# EasyEDA Pro project VCA821_AD8367_AD8302相敏检波_TLC14滤波电容.eprj

# Schematic Schematic1

## Sheets
1 P1: Board Name: Board1; Create Date: 2025-03-30; Page Name: P1; Project Name: VCA821_AD8367_AD8302相敏检波_TLC14滤波电容; Schematic Name: Schematic1; Update Date: 2025-03-31; Company: 嘉立创EDA; Page Size: A4; Version: V1.0
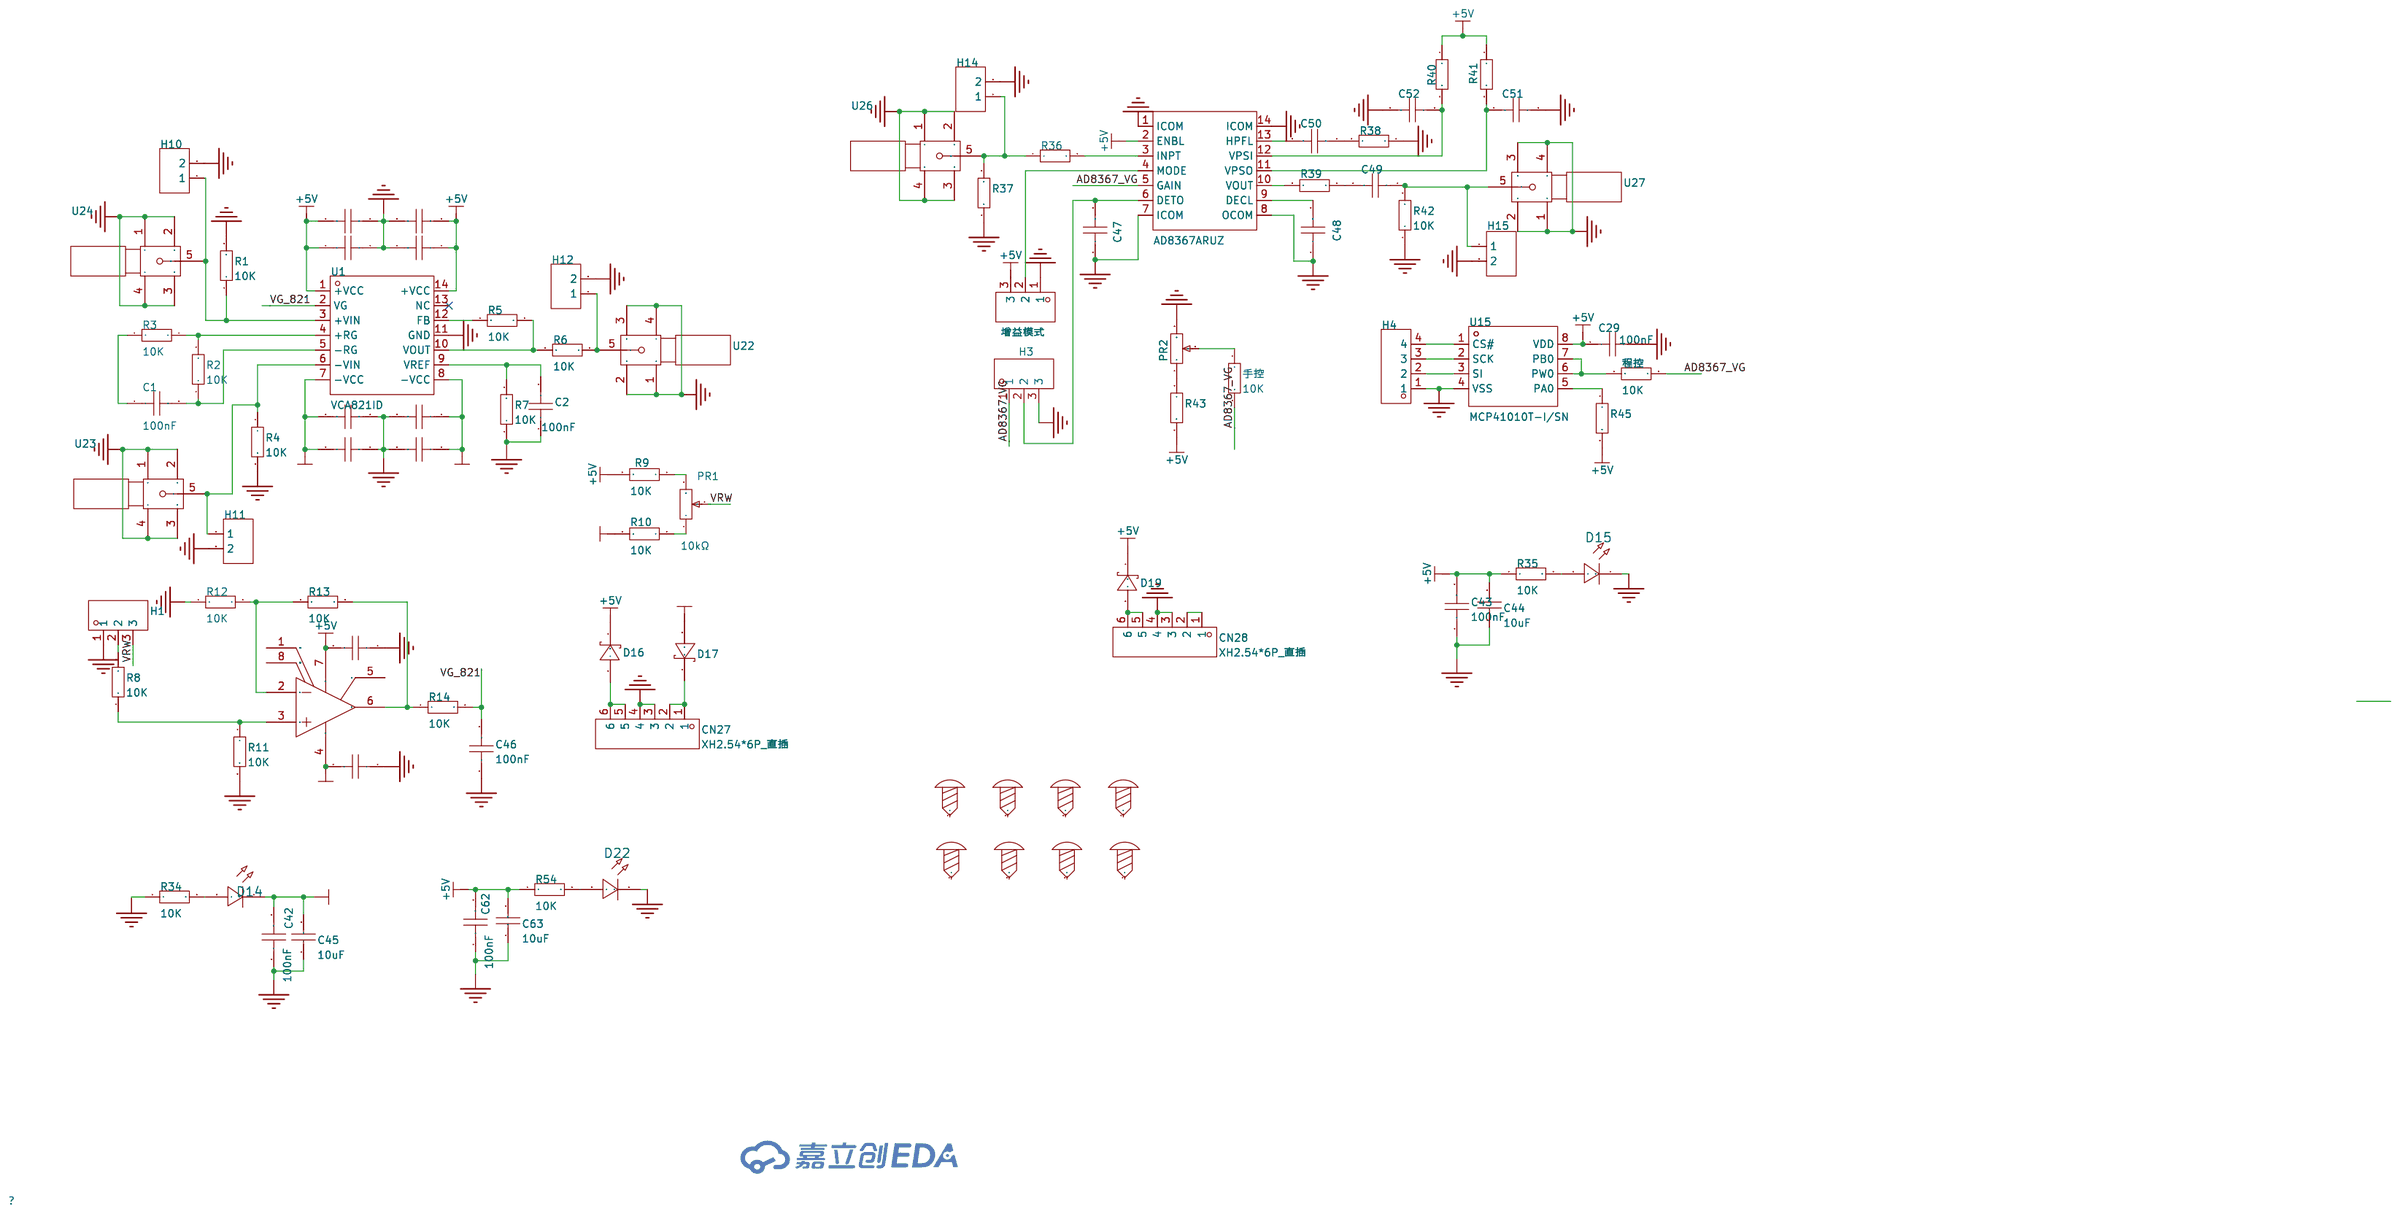
[diagram p0: P1]
2 P2: Page Name: P2
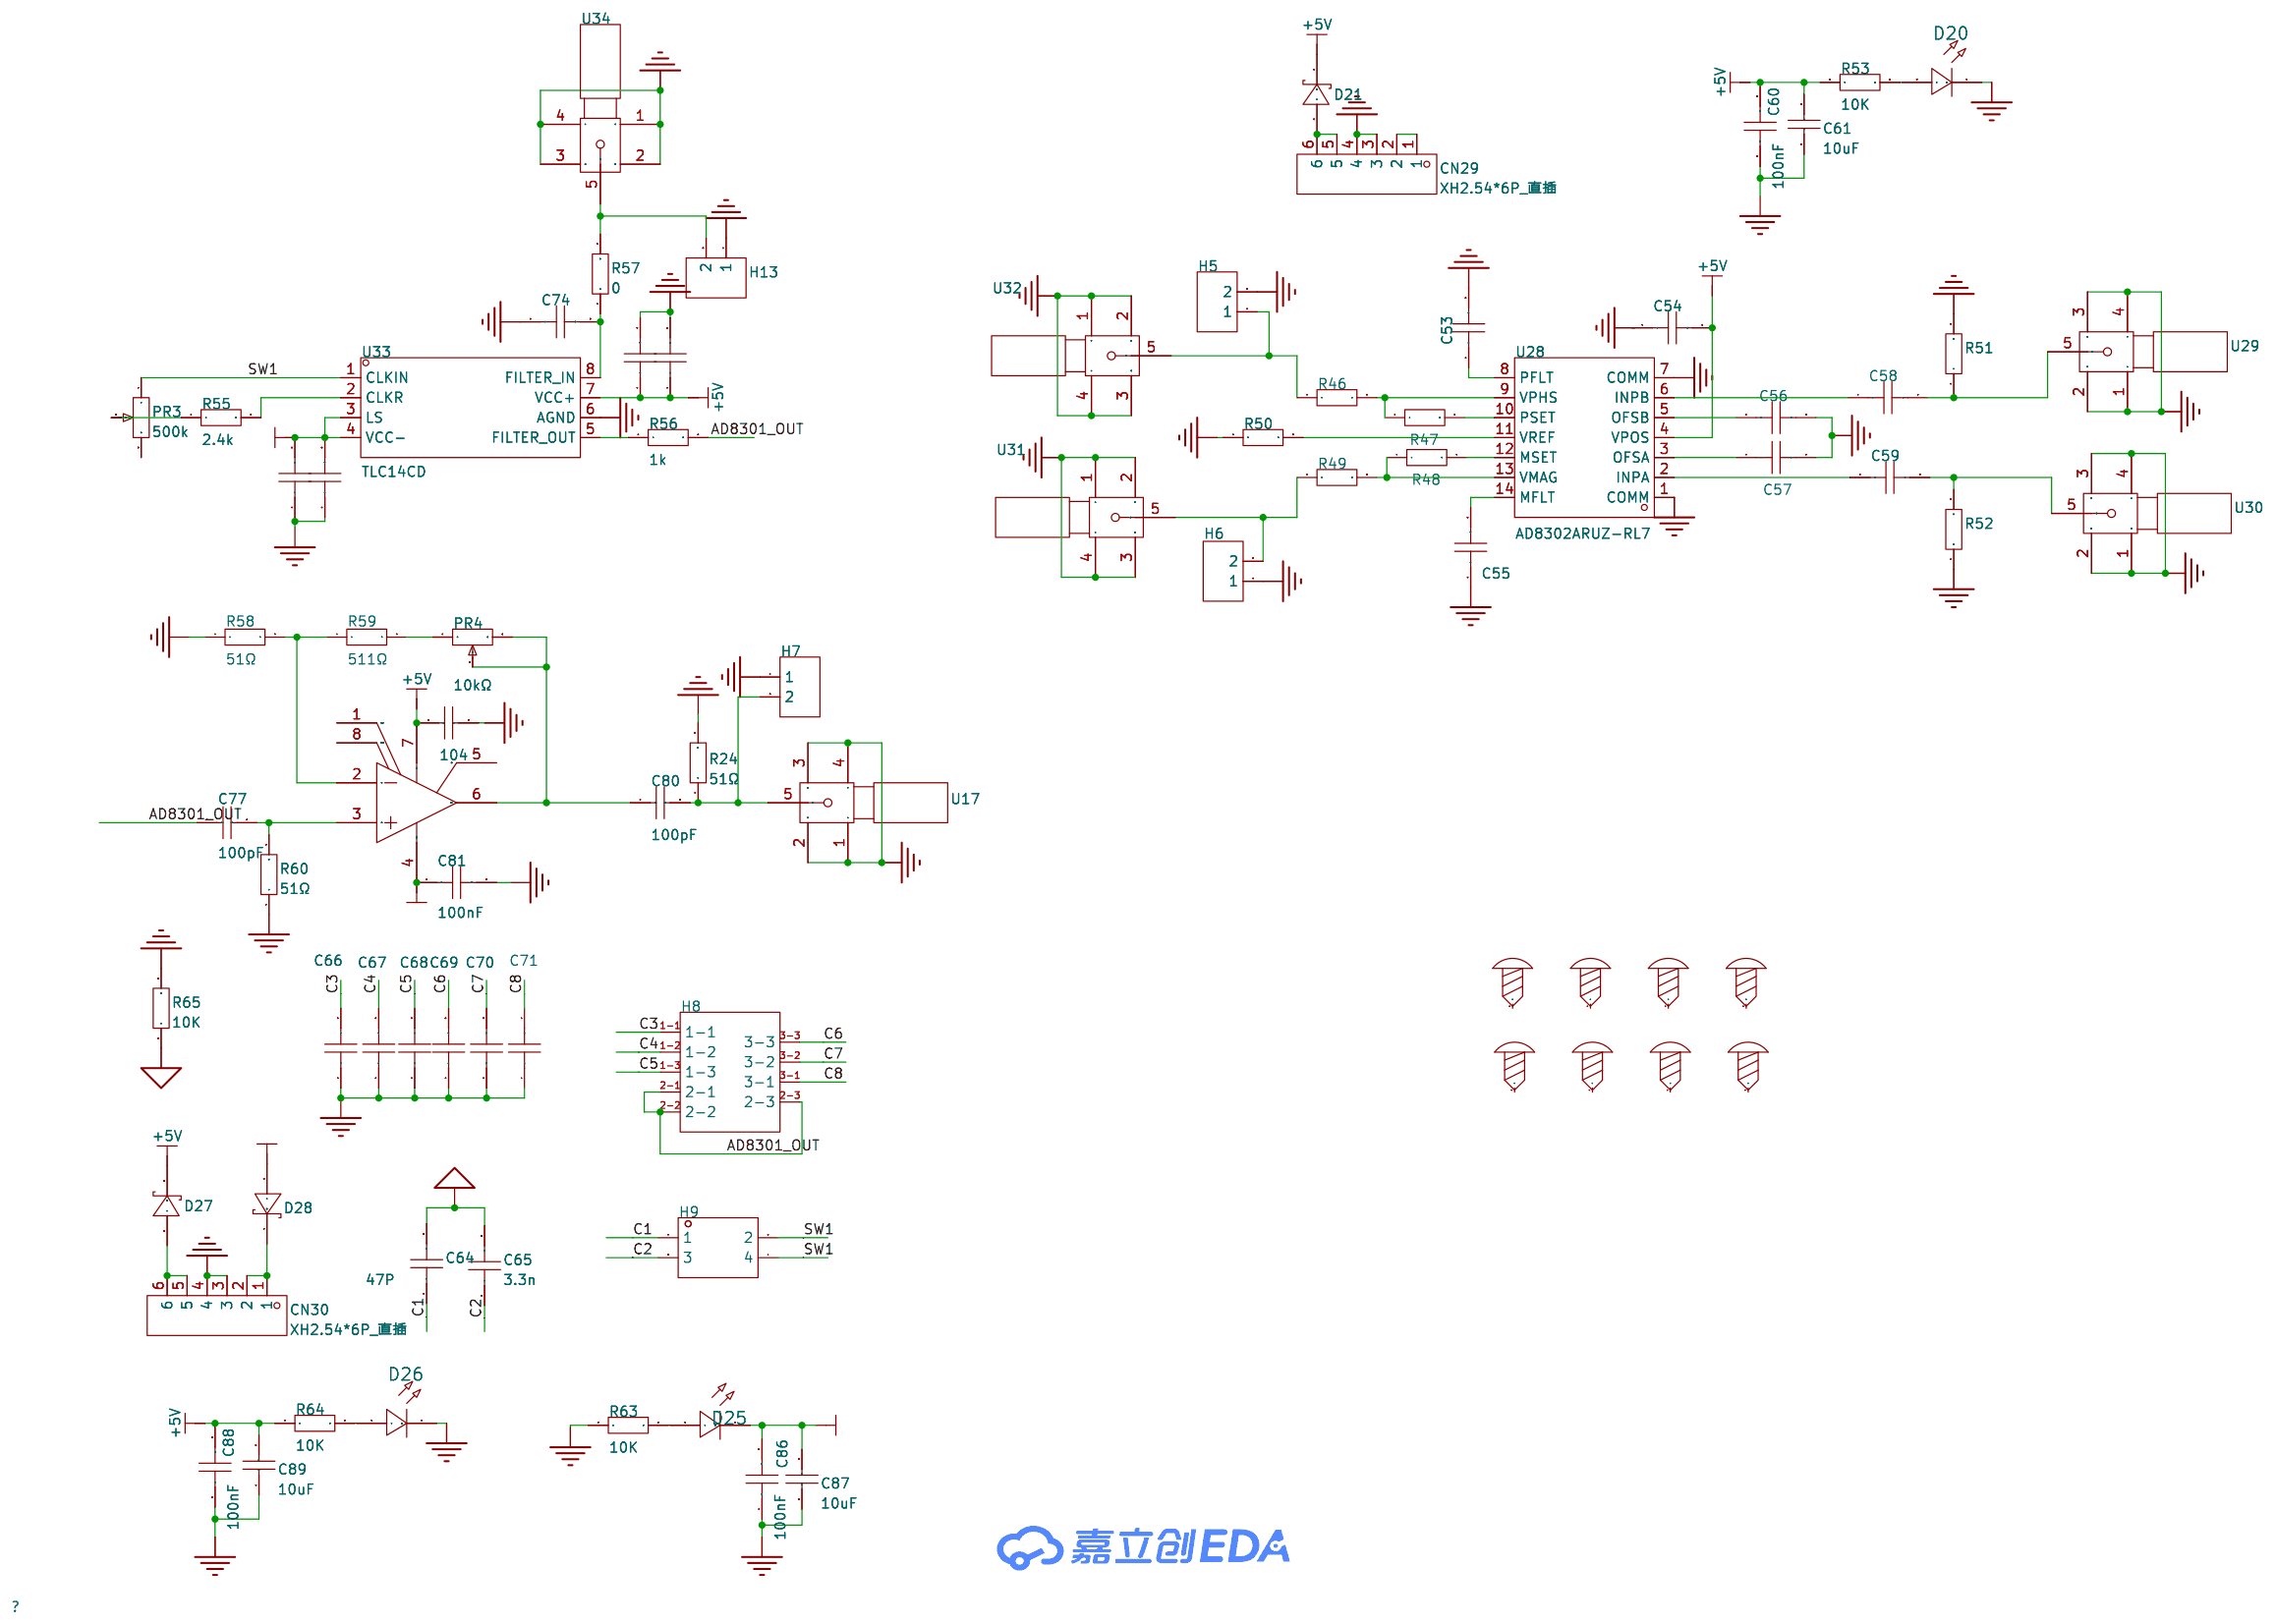
[diagram p1: P2]

## Parts
sheet P1
C1  100nF  [R0805]
C2  100nF  [R0805]
C3  100nF  [R0805]
C4  100nF  [R0805]
C5  100nF  [R0805]
C6  100nF  [R0805]
C7  100nF  [R0805]
C8  100nF  [R0805]
C9  100nF  [R0805]
C10  100nF  [R0805]
C11  100nF  [R0805]
C12  100nF  [R0805]
C29  100nF  [R0805]
C42  100nF  [R0805]
C43  100nF  [R0805]
C44  10uF  [C1210]
C45  10uF  [C1210]
C46  100nF  [R0805]
C47  100nF  [R0805]
C48  100nF  [R0805]
C49  100nF  [R0805]
C50  100nF  [R0805]
C51  100nF  [R0805]
C52  100nF  [R0805]
C62  100nF  [R0805]
C63  10uF  [C1210]
CN27  XH2.54*6P_直插  [CONN-TH_XH2.54-6P]
CN28  XH2.54*6P_直插  [CONN-TH_XH2.54-6P]
D14  -  [LED_0805]
D15  -  [LED_0805]
D16  SD103AWS  [SOD-323_L1.8-W1.3-LS2.5-RD]
D17  SD103AWS  [SOD-323_L1.8-W1.3-LS2.5-RD]
D19  SD103AWS  [SOD-323_L1.8-W1.3-LS2.5-RD]
D22  -  [LED_0805]
H1  -  [HDR-TH_3P-P2.54-V-F]
H3  -  [HDR-TH_3P-P2.54-V-F]
H4  -  [HDR-TH_4P-P2.54-V-F]
H10  -  [HDR-TH_2P-P2.54-V-F]
H11  -  [HDR-TH_2P-P2.54-V-F]
H12  -  [HDR-TH_2P-P2.54-V-F]
H14  -  [HDR-TH_2P-P2.54-V-F]
H15  -  [HDR-TH_2P-P2.54-V-F]
PR1  10kΩ  [R_3296]
PR2  10kΩ  [R_3296]
R1  10K  [R0805]
R2  10K  [R0805]
R3  10K  [R0805]
R4  10K  [R0805]
R5  10K  [R0805]
R6  10K  [R0805]
R7  10K  [R0805]
R8  10K  [R0805]
R9  10K  [R0805]
R10  10K  [R0805]
R11  10K  [R0805]
R12  10K  [R0805]
R13  10K  [R0805]
R14  10K  [R0805]
R34  10K  [R0805]
R35  10K  [R0805]
R36  10K  [R0805]
R37  10K  [R0805]
R38  10K  [R0805]
R39  10K  [R0805]
R40  10K  [R0805]
R41  10K  [R0805]
R42  10K  [R0805]
R43  10K  [R0805]
R45  10K  [R0805]
R54  10K  [R0805]
SCREW1  -  [M3螺丝]
SCREW2  -  [M3螺丝]
SCREW3  -  [M3螺丝]
SCREW4  -  [M3螺丝]
SCREW5  -  [M3螺丝]
SCREW6  -  [M3螺丝]
SCREW7  -  [M3螺丝]
SCREW8  -  [M3螺丝]
U1  VCA821ID  [SOIC-14_L8.7-W3.9-P1.27-LS6.0-BL]
U2  OP07CDR  [SOIC-8_L4.9-W3.9-P1.27-LS6.0-BL]
U15  MCP41010T-I/SN  [SOIC-8_L4.9-W3.9-P1.27-LS6.0-BL]
U22  -  [SMA]
U23  -  [SMA]
U24  -  [SMA]
U25  AD8367ARUZ  [TSSOP-14_L5.0-W4.4-P0.65-LS6.4-BL]
U26  -  [SMA]
U27  -  [SMA]
增益模式  -  [HDR-TH_3P-P2.54-V-F]
手控  10K  [R0805]
程控  10K  [R0805]
sheet P2
C53  100nF  [R0805]
C54  100nF  [R0805]
C55  100nF  [R0805]
C56  100nF  [R0805]
C57  100nF  [R0805]
C58  100nF  [R0805]
C59  100nF  [R0805]
C60  100nF  [R0805]
C61  10uF  [C1210]
C64  47P  [R0805]
C65  3.3n  [R0805]
C66  1nF  [R0805]
C67  100nF  [R0805]
C68  100nF  [R0805]
C69  100nF  [R0805]
C70  100nF  [R0805]
C71  100nF  [R0805]
C72  100nF  [R0805]
C73  100nF  [R0805]
C74  100nF  [R0805]
C75  100nF  [R0805]
C76  100nF  [R0805]
C77  100pF  [R0805]
C79  104  [R0805]
C80  100pF  [R0805]
C81  100nF  [R0805]
C86  100nF  [R0805]
C87  10uF  [C1210]
C88  100nF  [R0805]
C89  10uF  [C1210]
CN29  XH2.54*6P_直插  [CONN-TH_XH2.54-6P]
CN30  XH2.54*6P_直插  [CONN-TH_XH2.54-6P]
D20  -  [LED_0805]
D21  SD103AWS  [SOD-323_L1.8-W1.3-LS2.5-RD]
D25  -  [LED_0805]
D26  -  [LED_0805]
D27  SD103AWS  [SOD-323_L1.8-W1.3-LS2.5-RD]
D28  SD103AWS  [SOD-323_L1.8-W1.3-LS2.5-RD]
H5  -  [HDR-TH_2P-P2.54-V-F]
H6  -  [HDR-TH_2P-P2.54-V-F]
H7  -  [HDR-TH_2P-P2.54-V-F]
H8  PZ254-3-03-Z-2.5-G0  [HDR-TH_9P-P2.54-V-M-R3-C3-S2.54]
H9  -  [HDR-TH_4P-P2.54-V-F-R2-C2-S2.54]
H13  -  [HDR-TH_2P-P2.54-V-F]
PR3  500k  [R_3296]
PR4  10kΩ  [R_3296]
R24  51Ω  [R0805]
R46  10K  [R0805]
R47  10K  [R0805]
R48  10K  [R0805]
R49  10K  [R0805]
R50  10K  [R0805]
R51  10K  [R0805]
R52  10K  [R0805]
R53  10K  [R0805]
R55  2.4k  [R0805]
R56  1k  [R0805]
R57  0  [R0805]
R58  51Ω  [R0805]
R59  511Ω  [R0805]
R60  51Ω  [R0805]
R63  10K  [R0805]
R64  10K  [R0805]
R65  10K  [R0805]
SCREW17  -  [M3螺丝]
SCREW18  -  [M3螺丝]
SCREW19  -  [M3螺丝]
SCREW20  -  [M3螺丝]
SCREW21  -  [M3螺丝]
SCREW22  -  [M3螺丝]
SCREW23  -  [M3螺丝]
SCREW24  -  [M3螺丝]
U17  -  [SMA]
U28  AD8302ARUZ-RL7  [TSSOP-14_L5.0-W4.4-P0.65-LS6.4-BL]
U29  -  [SMA]
U30  -  [SMA]
U31  -  [SMA]
U32  -  [SMA]
U33  TLC14CD  [SOIC-8_L4.9-W3.9-P1.27-LS6.0-BL]
U34  -  [SMA]
U35  OP07CDR  [SOIC-8_L4.9-W3.9-P1.27-LS6.0-BL]

## Library data of the parts
C1-C12 C29 C42 C43 C46-C60 C62 C64-C76 C81 C86 C88 = CAP_0805: Supplier Footprint: 0805
C44 C45 C61 C63 C87 C89 = CL32B106KAJNNNE: 容值:10uF;精度:±10%;额定电压:25V;材质(温度系数):X7R;; LCSC Part Name: 10uF ±10% 25V; Supplier Part: C39232; Manufacturer: SAMSUNG(三星); Supplier Footprint: 1210; JLCPCB Part Class: 扩展库; Datasheet: https://atta.szlcsc.com/upload/public/pdf/source/20160218/1457707763339.pdf; Supplier: LCSC; Tolerance: ±10%; Voltage Rated: 25V; Temperature Coefficient: X7R
CN27-CN30 = XH2.54*6P_直插: Supplier Part: C9900008614; Supplier Footprint: XH2.54_6P; JLCPCB Part Class: 扩展库; Supplier: LCSC
D14 D15 D20 D22 D25 D26 = LED_0805-R: Supplier Footprint: 0805
D16 D17 D19 D21 D27 D28 = SD103AWS_C181207: 正向压降(Vf):600mV@200mA;直流反向耐压(Vr):40V;整流电流:350mA;; LCSC Part Name: 电压:40V 电流:350mA 丝印S4; Supplier Part: C181207; Manufacturer: Hottech(合科泰); Supplier Footprint: SOD-323; JLCPCB Part Class: 扩展库; Datasheet: https://atta.szlcsc.com/upload/public/pdf/source/20240513/4691873FBB9173EFBCF4C6FD4BBA1025.pdf; Supplier: LCSC; Forward Voltage (Vf@If): 600mV@200mA; Reverse Voltage (Vr): 40V; Rectified Current: 350mA
H1 H3 增益模式 = HDR-F_2.54_1x3P: Supplier Part: C541850; Supplier Footprint: 插件
H4 = HDR-F_2.54_1x4P: Supplier Part: C2718488; Supplier Footprint: 插件
H5-H7 H10-H15 = HDR-F_2.54_1x2P: Supplier Part: C49661; Supplier Footprint: 插件
PR1-PR4 = R_3296: Supplier Footprint: 直插
R1-R14 R34-R43 R45-R57 R63-R65 手控 程控 = Res_0805: Supplier Footprint: 0805
SCREW1-SCREW8 SCREW17-SCREW24 = M3螺丝: Supplier Footprint: 插件
U1 = VCA821ID: Supplier Part: C2866982; Manufacturer: TI(德州仪器); Supplier Footprint: SOIC-14; JLCPCB Part Class: 扩展库; Datasheet: https://www.ti.com/cn/lit/gpn/vca821; Supplier: LCSC; Amplifier Type: VGA; Number of Channels: 单路; Bandwidth (-3dB): 710MHz; Slew Rate (SR): 2500V/us; Output Current: 90mA; Supply Current: 34mA; Operating Temperature: -40℃~+85℃
U2 U35 = OP07CDR: LCSC Part Name: 精密运算放大器; Supplier Part: C7433; Manufacturer: TI(德州仪器); Supplier Footprint: SOIC-8; JLCPCB Part Class: 基础库; Datasheet: http://www.ti.com/cn/lit/gpn/op07c; Supplier: LCSC; Number of Circuits: 单路; Gain Bandwidth Product(GBP): 600kHz; Current - Input Bias(Ib): 1.8nA; Slew Rate(SR): 0.3V/us; Operating Temperature: 0℃~+70℃
U15 = MCP41010T-I/SN: 电阻值(欧姆):10kΩ;精度:±20%;供电电压:2.7V~5.5V;接口类型:SPI;; Supplier Part: C136395; Manufacturer: MICROCHIP(美国微芯); Supplier Footprint: SOIC-8-150mil; JLCPCB Part Class: 扩展库; Datasheet: https://atta.szlcsc.com/upload/public/pdf/source/20220205/C2666606_C5E8E7A5F3891B321C1555D845654E7B.pdf; Supplier: LCSC; Resistance Value (Ohms): 10kΩ; Number of Taps: 256; Number of Channels: 1; Precision: ±20%; Supply Voltage: 2.7V~5.5V; Interface Type: SPI; Temperature Coefficient (Typ): 800ppm/℃; Operating Temperature: -40℃~+85℃
U17 U22-U24 U26 U27 U29-U32 U34 = SMA
U25 = AD8367ARUZ: LCSC Part Name: 500 MHz 、45dB线性dB可变增益放大器; Supplier Part: C578713; Manufacturer: ADI(亚德诺); Supplier Footprint: TSSOP-14; JLCPCB Part Class: 扩展库; Datasheet: https://atta.szlcsc.com/upload/public/pdf/source/20200408/C191561_25904AF254F64640D2A0ECFC6C3DB0D9.pdf; Supplier: LCSC; Number of Channels: 单路; -3dB Bandwidth: 500MHz; Current - Supply: 26mA
C77 C79 C80 = CL21C101JBANNNC: 容值:100pF;精度:±5%;额定电压:50V;材质(温度系数):C0G;; LCSC Part Name: 100pF ±5% 50V; Supplier Part: C1790; Manufacturer: SAMSUNG(三星); Supplier Footprint: 0805; JLCPCB Part Class: 基础库; Datasheet: https://atta.szlcsc.com/upload/public/pdf/source/20160218/1457707763339.pdf; Supplier: LCSC; Tolerance: ±5%; Voltage Rated: 50V; Temperature Coefficient: C0G
H8 = PZ254-3-03-Z-2.5-G0: LCSC Part Name: 黑色 3x3P 间距:2.54mm 方针 直插; Supplier Part: C7429377; Manufacturer: HCTL(华灿天禄); Supplier Footprint: 插件,P=2.54mm; JLCPCB Part Class: 扩展库; Datasheet: https://atta.szlcsc.com/upload/public/pdf/source/20231019/FA993AF7588ADE43F1B4631F14948A48.pdf; Supplier: LCSC; Pin Structure: 3x3P; Pitch: 2.54mm; Row Spacing: 2.54mm; Circluar Pins/Square Pins: 方针; Mounting Type: 直插; Number of Rows: 三排; Number of Pins: 9P; Current Rating: 3A; Length of Mating Pin: 6mm; Insulation Height: 2.5mm; Length of End Connection Pin: 3mm; Contact Material: 黄铜; Operating Temperature: -40℃~+105℃; Color: 黑色
H9 = HDR-F_2.54_2x2: Supplier Part: C92273; Supplier Footprint: 插件
R24 R58 R60 = 0805W8F510JT5E: 电阻类型:厚膜电阻;阻值:51Ω;精度:±1%;功率:125mW;最大工作电压:150V;温度系数:±100ppm/℃;; LCSC Part Name: 51Ω ±1% 125mW 厚膜电阻; Supplier Part: C17738; Manufacturer: UNI-ROYAL(厚声); Supplier Footprint: 0805; JLCPCB Part Class: 基础库; Datasheet: https://atta.szlcsc.com/upload/public/pdf/source/20200306/C422600_1E6D84923E4A46A82E41ADD87F860B5C.pdf; Supplier: LCSC; Type: 厚膜电阻; Tolerance: ±1%; Power(Watts): 125mW; Overload Voltage (Max): 150V; Temperature Coefficient: ±100ppm/℃; Operating Temperature Range: -55℃~+155℃
R59 = 0805W8F5110T5E: 电阻类型:厚膜电阻;阻值:511Ω;精度:±1%;功率:125mW;最大工作电压:150V;温度系数:±100ppm/℃;; LCSC Part Name: 511Ω ±1% 125mW 厚膜电阻; Supplier Part: C17736; Manufacturer: UNI-ROYAL(厚声); Supplier Footprint: 0805; JLCPCB Part Class: 扩展库; Datasheet: https://atta.szlcsc.com/upload/public/pdf/source/20200306/C422600_1E6D84923E4A46A82E41ADD87F860B5C.pdf; Supplier: LCSC; Type: 厚膜电阻; Tolerance: ±1%; Power(Watts): 125mW; Overload Voltage (Max): 150V; Temperature Coefficient: ±100ppm/℃; Operating Temperature Range: -55℃~+155℃
U28 = AD8302ARUZ-RL7: LCSC Part Name: RF/IF增益和相位检波器; Supplier Part: C408900; Manufacturer: ADI(亚德诺); Supplier Footprint: TSSOP-14; JLCPCB Part Class: 扩展库; Datasheet: https://atta.szlcsc.com/upload/public/pdf/source/20190807/C408900_5BB3D180A454BA6F4D99553AB0F529A5.pdf; Supplier: LCSC; Applications: 通用; Frequency Range: 2.7GHz; Input Range: -60dBm~0dBm; Supply Voltage: 2.7V~5.5V; Supply Current: 23mA; Accuracy: ±0.5dB
U33 = TLC14CD: Supplier Part: C157350; Manufacturer: TI(德州仪器); Supplier Footprint: SOIC-8; JLCPCB Part Class: 扩展库; Datasheet: https://www.ti.com/cn/lit/gpn/tlc14; Supplier: LCSC; Filter Type: 低通滤波器；巴特沃斯滤波器; Filter Order: 4; Number of Filters: 1

## Nets
+5V: C3.2 C4.1 C7.2 C11.2 C12.1 C29.1 C43.2 C44.2 C54.2 C60.2 C61.2 C62.2 C63.2 C72.1 C73.1 C79.2 C88.2 C89.2 D16.1(C) D19.1(C) D21.1(C) D27.1(C) R9.2 R35.1 R40.1 R41.1 R43.2 R45.2 R53.1 R54.1 R64.1 U1.1(+VCC) U1.14(+VCC) U2.7(VCC+) U15.8(VDD) U25.2(ENBL) U28.4(VPOS) U33.7(VCC+) U35.7(VCC+) 增益模式.3
-5V: C5.2 C6.1 C8.2 C9.2 C10.1 C42.2 C45.2 C75.2 C76.2 C81.1 C86.2 C87.2 D14.1(C) D17.2(A) D25.1(C) D28.2(A) R10.2 U1.7(-VCC) U1.8(-VCC) U2.4(VCC-) U33.3(LS) U33.4(VCC-) U35.4(VCC-)
AGND: C64.2 C65.2 R65.1
GND: C2.1 C3.1 C4.2 C5.1 C6.2 C7.1 C8.1 C9.1 C10.2 C11.1 C12.2 C29.2 C42.1 C43.1 C44.1 C45.1 C46.1 C47.1 C48.1 C51.2 C52.1 C53.2 C54.1 C55.1 C56.2 C57.2 C60.1 C61.1 C62.1 C63.1 C66.1 C67.1 C68.1 C69.1 C70.1 C71.1 C72.2 C73.2 C74.1 C75.1 C76.1 C79.1 C81.2 C86.1 C87.1 C88.1 C89.1 CN27.3 CN27.4 CN28.3 CN28.4 CN29.3 CN29.4 CN30.3 CN30.4 D15.1(C) D20.1(C) D22.1(C) D26.1(C) H1.1 H3.3 H4.1 H5.2 H6.1 H7.1 H10.2 H11.2 H12.2 H13.1 H14.2 H15.2 PR2.3 R1.2 R4.2 R7.1 R11.2 R12.1 R24.2 R34.1 R37.1 R38.1 R42.1 R50.1 R51.2 R52.1 R58.1 R60.1 R63.1 R65.2 U1.11(GND) U15.4(VSS) U17.1 U17.2 U17.3 U17.4 U22.1 U22.2 U22.3 U22.4 U23.1 U23.2 U23.3 U23.4 U24.1 U24.2 U24.3 U24.4 U25.1(ICOM) U25.7(ICOM) U25.8(OCOM) U25.14(ICOM) U26.1 U26.2 U26.3 U26.4 U27.1 U27.2 U27.3 U27.4 U28.1(COMM) U28.7(COMM) U29.1 U29.2 U29.3 U29.4 U30.1 U30.2 U30.3 U30.4 U31.1 U31.2 U31.3 U31.4 U32.1 U32.2 U32.3 U32.4 U33.6(AGND) U34.1 U34.2 U34.3 U34.4 增益模式.1
AD8301_OUT: C77.1 H8.2-1 H8.2-2 H8.2-3 R56.2
AD8367_VG: H3.1 U25.5(GAIN) 手控.2 程控.2
C1: C64.1 H9.1
C2: C65.1 H9.3
C3: C66.2 H8.1-1
C4: C67.2 H8.1-2
C5: C68.2 H8.1-3
C6: C69.2 H8.3-3
C7: C70.2 H8.3-2
C8: C71.2 H8.3-1
SW1: H9.2 H9.4 PR3.1 U33.1(CLKIN)
VG_821: C46.2 R14.2 U1.2(VG)
VRW: H1.3 PR1.2
$1N927: H10.1 R1.1 U1.3(+VIN) U24.5
$1N932: R2.2 R3.1 U1.4(+RG)
$1N947: C1.1 R3.2
$1N953: C1.2 R2.1 U1.5(-RG)
$1N958: H11.1 R4.1 U1.6(-VIN) U23.5
$1N1412: R5.1 U1.12(FB)
$1N1418: R5.2 R6.1 U1.10(VOUT)
$1N1424: C2.2 R7.2 U1.9(VREF)
$1N1956: D15.2(A) R35.2
$1N1959: D14.2(A) R34.2
$1N1963: CN27.1 CN27.2 D17.1(C)
$1N1964: CN27.5 CN27.6 D16.2(A)
$1N2033: R12.2 R13.1 U2.2(IN-)
$1N2043: R13.2 R14.1 U2.6(OUT)
$1N2183: R8.1 R11.1 U2.3(IN+)
$1N2225: H1.2 R8.2
$1N2322: PR1.3 R9.1
$1N2326: PR1.1 R10.1
$1N2584: H12.1 R6.2 U22.5
$1N3187: R36.2 U25.3(INPT)
$1N3196: H14.1 R36.1 R37.2 U26.5
$1N3201: C47.2 H3.2 U25.6(DETO)
$1N3346: U25.4(MODE) 增益模式.2
$1N3385: C50.2 U25.13(HPFL)
$1N3390: C50.1 R38.2
$1N3425: R39.2 U25.10(VOUT)
$1N3431: C49.2 R39.1
$1N3468: C48.2 U25.9(DECL)
$1N3506: C49.1 H15.1 R42.2 U27.5
$1N3541: C52.2 R40.2 U25.12(VPSI)
$1N3546: C51.1 R41.2 U25.11(VPSO)
$1N4146: PR2.1 R43.1
$1N4385: R45.1 U15.5(PA0)
$1N4386: U15.6(PW0) U15.7(PB0) 程控.1
$1N4389: H4.4 U15.1(CS#)
$1N4390: H4.3 U15.2(SCK)
$1N4391: H4.2 U15.3(SI)
$1N4449: PR2.2 手控.1
$1N4593: CN28.1 CN28.2
$1N4594: CN28.5 CN28.6 D19.2(A)
$1N6399: D22.2(A) R54.2
$2N3603: C80.1 PR4.2 PR4.3 U35.6(OUT)
$2N3604: C80.2 H7.2 R24.1 U17.5
$2N3622: C77.2 R60.2 U35.3(IN+)
$2N3623: R58.2 R59.1 U35.2(IN-)
$2N3624: PR4.1 R59.2
$2N3626: R55.2 U33.2(CLKR)
$2N3634: R56.1 U33.5(FILTER_OUT)
$2N3638: C74.2 R57.1 U33.8(FILTER_IN)
$2N3668: D26.2(A) R64.2
$2N3679: CN30.1 CN30.2 D28.1(C)
$2N3680: CN30.5 CN30.6 D27.2(A)
$2N3682: D25.2(A) R63.2
$2N3685: H13.2 R57.2 U34.5
$2N3731: PR3.2 R55.1
$2N4779: C59.2 R52.2 U30.5
$2N4783: C58.2 R51.1 U29.5
$2N4786: D20.2(A) R53.2
$2N4787: R48.1 R49.2 U28.13(VMAG)
$2N4791: R46.2 R47.1 U28.9(VPHS)
$2N4792: R50.2 U28.11(VREF)
$2N4794: H6.2 R49.1 U31.5
$2N4795: H5.1 R46.1 U32.5
$2N4798: CN29.5 CN29.6 D21.2(A)
$2N4801: CN29.1 CN29.2
$2N4806: C55.2 U28.14(MFLT)
$2N4807: R48.2 U28.12(MSET)
$2N4808: R47.2 U28.10(PSET)
$2N4809: C53.1 U28.8(PFLT)
$2N4812: C56.1 U28.5(OFSB)
$2N4813: C57.1 U28.3(OFSA)
$2N4814: C59.1 U28.2(INPA)
$2N4816: C58.1 U28.6(INPB)

Not connected (* = marked no-connect by the designer): PR3 3; SCREW1 1; SCREW2 1; SCREW3 1; SCREW4 1; SCREW5 1; SCREW6 1; SCREW7 1; SCREW8 1; SCREW17 1; SCREW18 1; SCREW19 1; SCREW20 1; SCREW21 1; SCREW22 1; SCREW23 1; SCREW24 1; U1 13(NC)*; U2 1(OFFSET N1) 5(NC) 8(OFFSET N2); U35 1(OFFSET N1) 5(NC) 8(OFFSET N2)

# Board PCB1
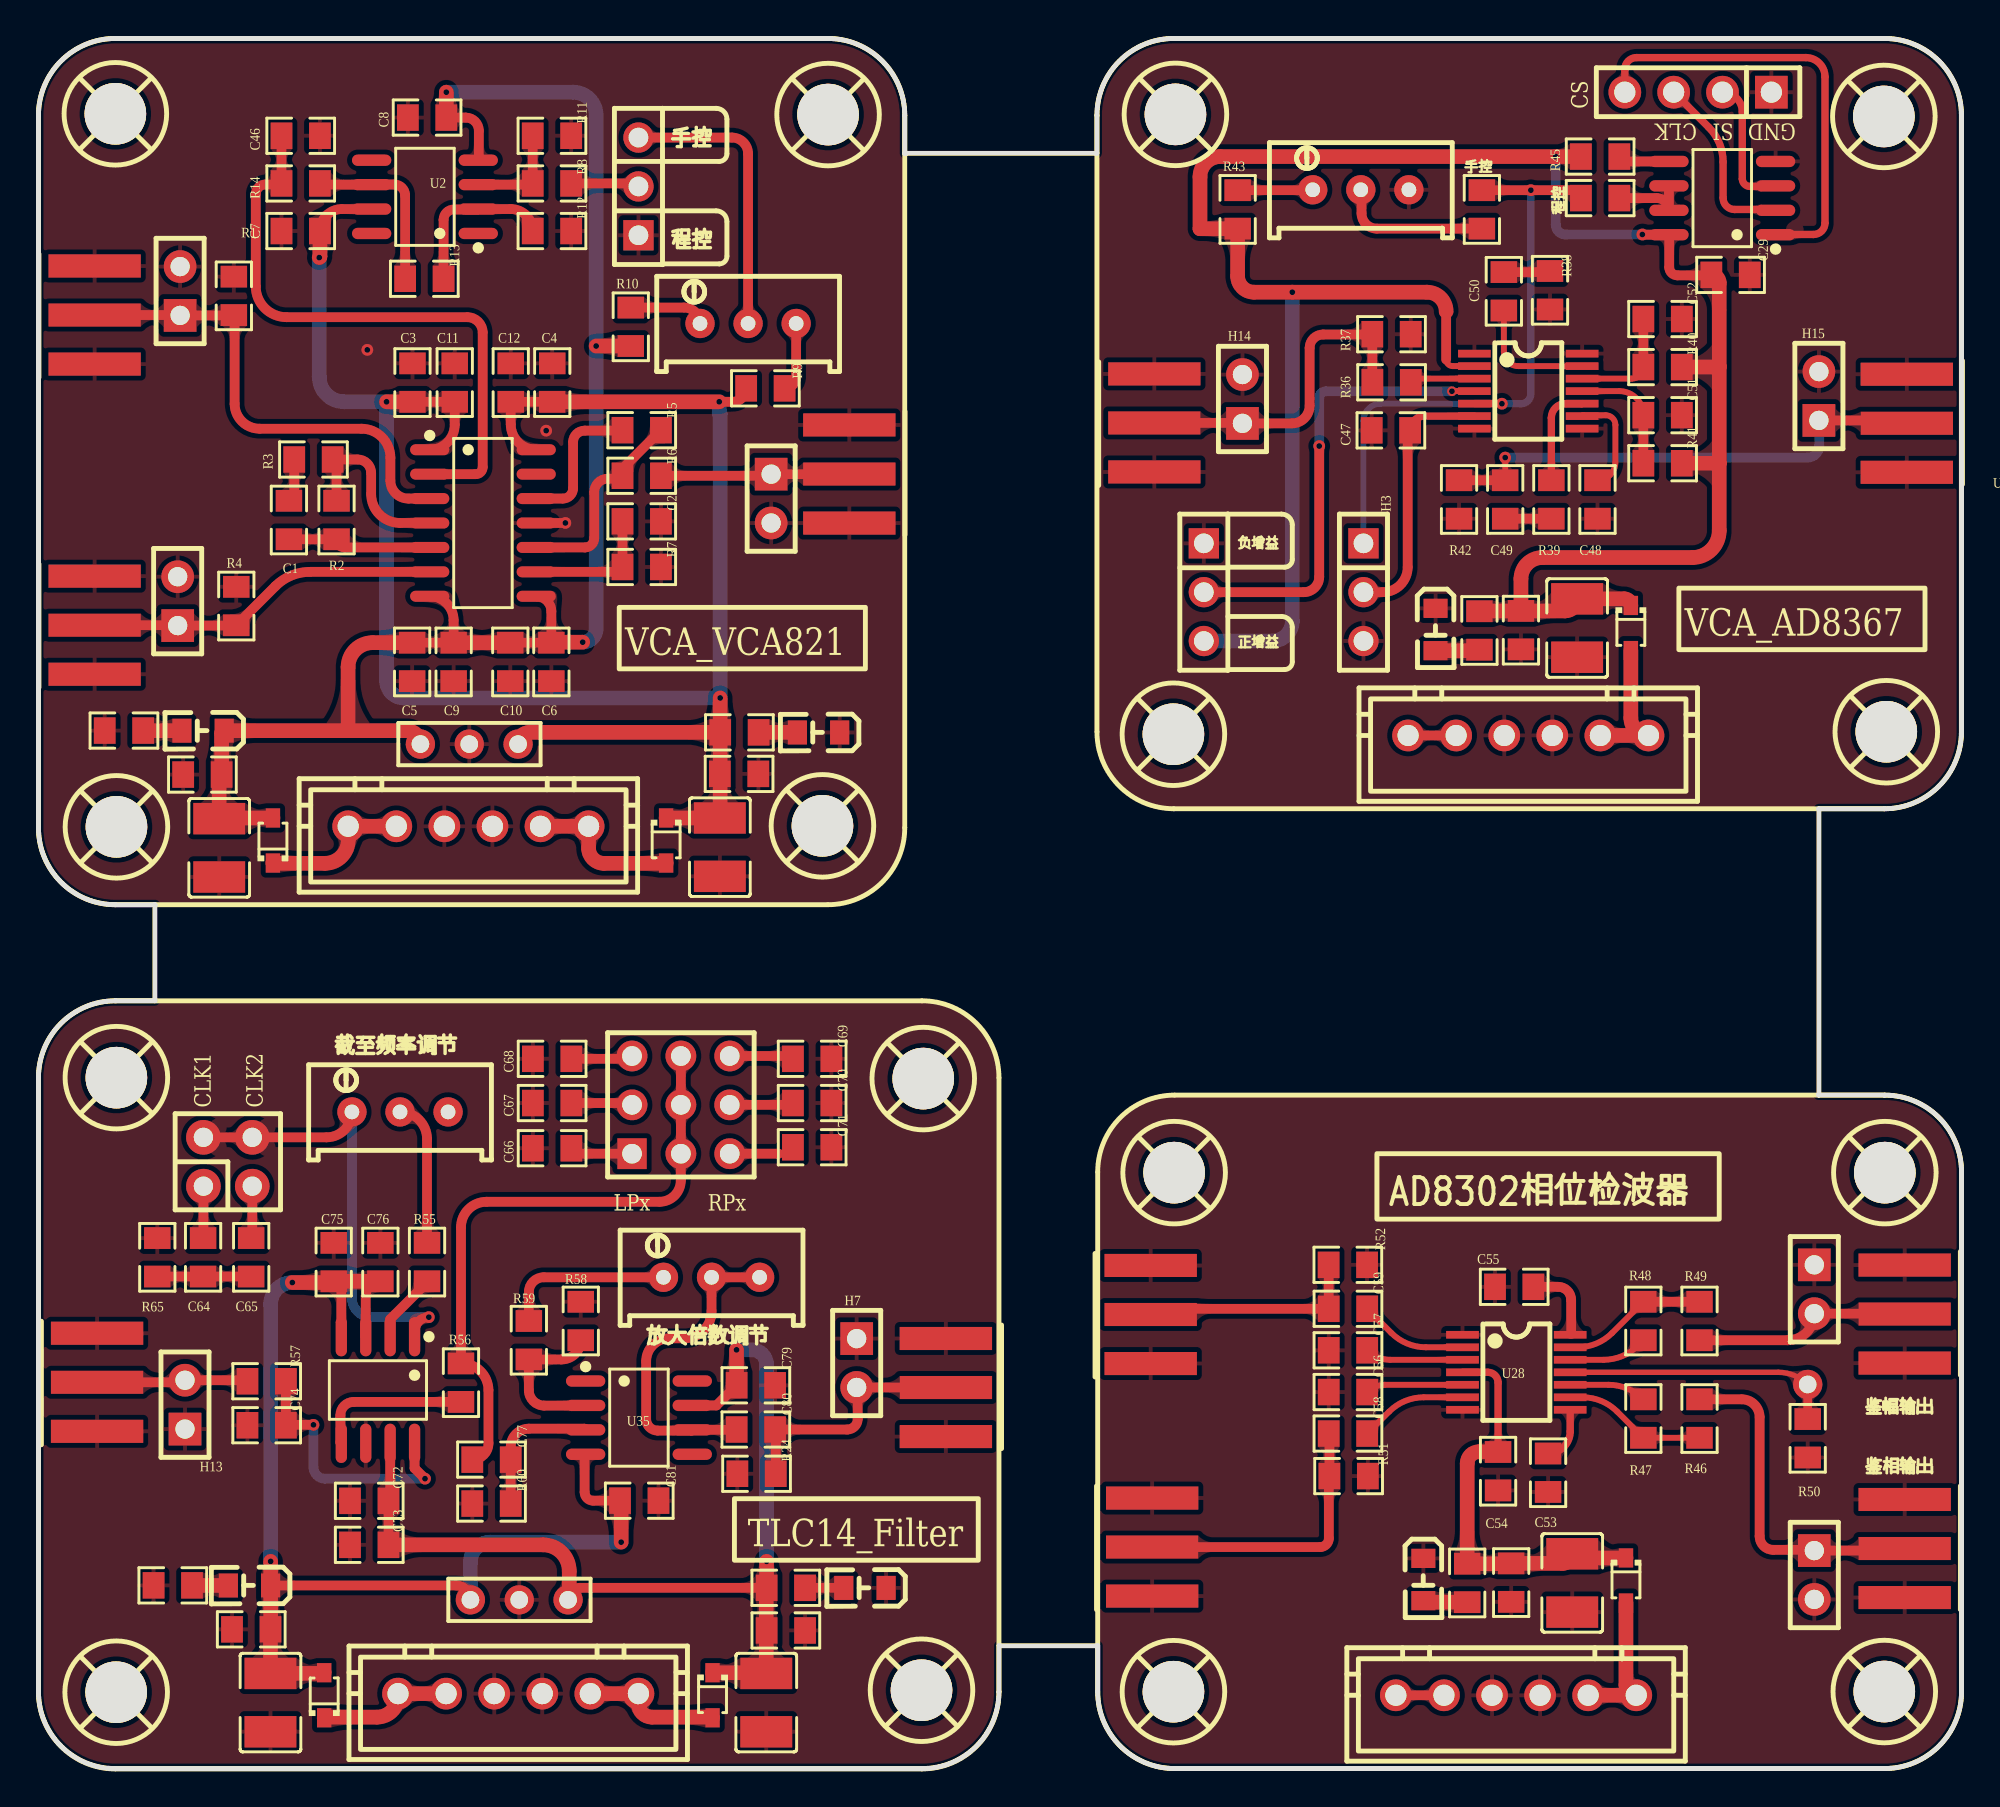
[diagram p2: board, top side]
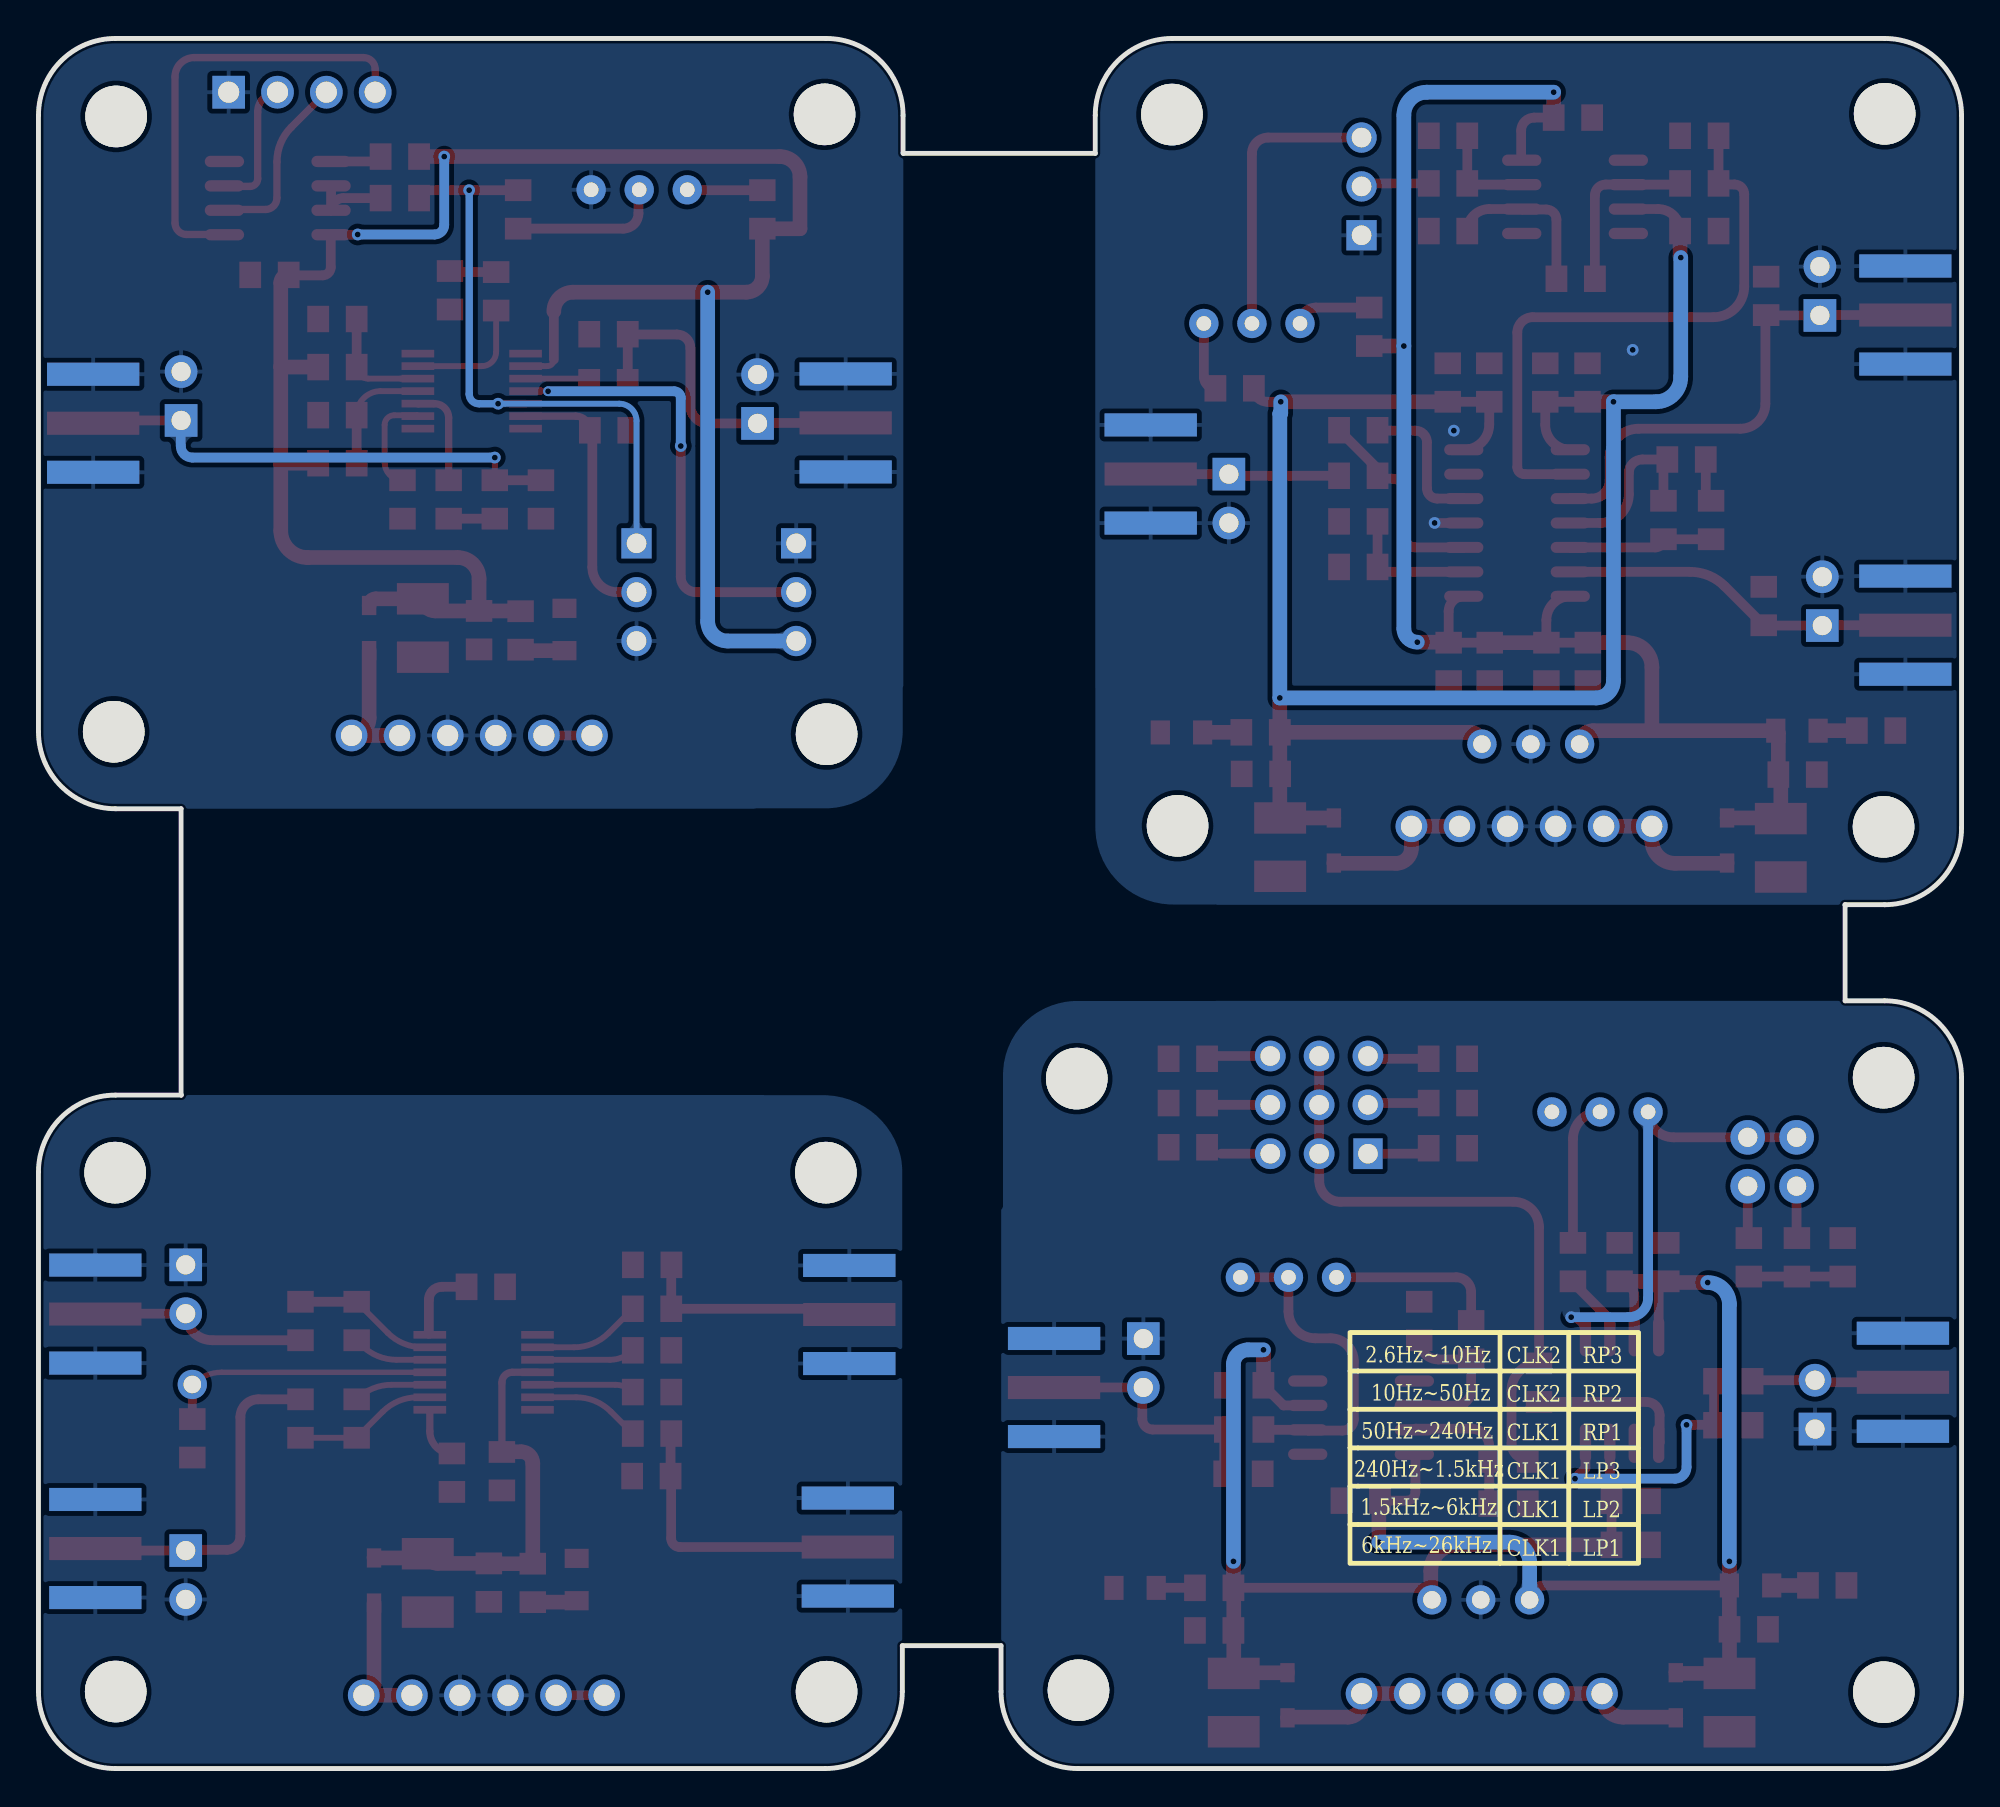
[diagram p3: board, bottom side, seen from below]

Outline 100 x 89.97 mm; copper layers: Top Layer, Bottom Layer. Coordinates in mm from the lower left corner of the outline.
Outline path: 0,85.97 arc(1.17,88.8) 4,89.97 41.05,89.97 arc(43.88,88.8) 45.05,85.97 45.05,83.99 55.03,83.99 arc(55.04,84) 55.04,84.01 55.04,85.97 arc(56.21,88.8) 59.04,89.97 96,89.97 arc(98.83,88.8) 100,85.97 100,53.92 arc(98.83,51.09) 95.99,49.91 92.58,49.91 92.58,35.03 arc(92.58,35.02) 92.58,35.02 96,35.02 arc(98.83,33.85) 100,31.02 100,4 arc(98.83,1.17) 96,0 59.08,0 arc(56.25,1.17) 55.08,4 55.08,6.39 49.95,6.39 49.95,4 arc(48.77,1.17) 45.95,0 4,0 arc(1.17,1.17) 0,4 0,35.92 arc(1.17,38.75) 4,39.92 6.05,39.92 6.05,44.92 arc(6.06,44.92) 6.06,44.92 4,44.92 arc(1.17,46.09) 0,48.92 0,85.97
Stack: Top Layer 0.035mm / Dielectric1 1.51mm FR4 er 4.5 / Bottom Layer 0.035mm

## Design rules (mm)
template: 自定义配置
spacing copperThickness1oz (default): track to track 0.102, other pairs 0.152 to 0.3
spacing copperThickness2oz: track to track 0.203, other pairs 0.152 to 0.3
track width copperThickness1oz (default): min 0.127, default 0.508, max 2.54
track width copperThickness2oz: min 0.203, default 0.254, max 2.54
differential pair differentialPair (default): width min 0.127, default 0.254, max 2.54; gap min 0.152, default 0.152
via viaSize (default): diameter min 0.5, default 0.61, max 10; hole min 0.3, default 0.305, max 6.3

## Placement (name value [footprint] x y rotation side)
C1  100nF  [R0805]  13.02 64.81 270 top
C2  100nF  [R0805]  31.26 64.85 180 top
C3  100nF  [R0805]  19.45 71.96 270 top
C4  100nF  [R0805]  26.72 72.18 90 top
C5  100nF  [R0805]  19.43 57.66 90 top
C6  100nF  [R0805]  26.67 57.44 270 top
C7  100nF  [R0805]  13.75 79.95 0 top
C8  100nF  [R0805]  20.32 85.85 0 top
C9  100nF  [R0805]  21.59 57.66 90 top
C10  100nF  [R0805]  24.53 57.44 270 top
C11  100nF  [R0805]  21.65 71.96 270 top
C12  100nF  [R0805]  24.56 72.18 90 top
C29  100nF  [R0805]  88.1 77.67 0 top
C42  100nF  [R0805]  8.64 51.69 0 top
C43  100nF  [R0805]  77.09 59.31 90 top
C44  10uF  [C1210]  80.01 59.31 90 top
C45  10uF  [C1210]  9.4 47.88 90 top
C46  100nF  [R0805]  13.53 84.91 180 top
C47  100nF  [R0805]  70.44 69.59 0 top
C48  100nF  [R0805]  81.07 66.1 90 top
C49  100nF  [R0805]  76.27 65.88 270 top
C50  100nF  [R0805]  76.2 76.71 270 top
C51  100nF  [R0805]  84.57 70.38 0 top
C52  100nF  [R0805]  84.34 75.38 180 top
C53  100nF  [R0805]  78.5 15.27 270 top
C54  100nF  [R0805]  75.9 15.57 90 top
C55  100nF  [R0805]  76.85 25.05 0 top
C56  100nF  [R0805]  67.98 19.58 180 top
C57  100nF  [R0805]  67.98 21.75 180 top
C58  100nF  [R0805]  67.98 17.42 180 top
C59  100nF  [R0805]  67.98 23.91 180 top
C60  100nF  [R0805]  76.58 9.78 90 top
C61  10uF  [C1210]  79.76 9.65 90 top
C62  100nF  [R0805]  36.32 51.72 180 top
C63  10uF  [C1210]  35.43 47.91 90 top
C64  47P  [R0805]  8.56 26.47 270 top
C65  3.3n  [R0805]  11.06 26.47 270 top
C66  1nF  [R0805]  26.82 32.26 0 top
C67  100nF  [R0805]  26.82 34.61 0 top
C68  100nF  [R0805]  26.82 36.91 0 top
C69  100nF  [R0805]  40.12 36.91 180 top
C70  100nF  [R0805]  40.12 34.61 180 top
C71  100nF  [R0805]  40.12 32.31 180 top
C72  100nF  [R0805]  17.09 13.92 180 top
C73  100nF  [R0805]  17.09 11.63 180 top
C74  100nF  [R0805]  11.98 17.85 0 top
C75  100nF  [R0805]  15.35 26.22 270 top
C76  100nF  [R0805]  17.78 26.22 270 top
C77  100pF  [R0805]  23.67 16.07 0 top
C79  104  [R0805]  37.19 19.93 180 top
C80  100pF  [R0805]  37.42 17.63 0 top
C81  100nF  [R0805]  31.35 13.93 0 top
C86  100nF  [R0805]  11.18 7.24 0 top
C87  10uF  [C1210]  12.06 3.43 90 top
C88  100nF  [R0805]  38.75 7.18 180 top
C89  10uF  [C1210]  37.85 3.43 90 top
CN27  XH2.54*6P_直插  [CONN-TH_XH2.54-6P]  22.36 49 0 top
CN28  XH2.54*6P_直插  [CONN-TH_XH2.54-6P]  77.47 53.72 0 top
CN29  XH2.54*6P_直插  [CONN-TH_XH2.54-6P]  76.84 3.81 0 top
CN30  XH2.54*6P_直插  [CONN-TH_XH2.54-6P]  24.95 3.9 0 top
D14  -  [LED_0805]  8.51 53.97 180 top
D15  -  [LED_0805]  72.64 59.18 270 top
D16  SD103AWS  [SOD-323_L1.8-W1.3-LS2.5-RD]  32.64 48.26 270 top
D17  SD103AWS  [SOD-323_L1.8-W1.3-LS2.5-RD]  12.19 48.26 90 top
D19  SD103AWS  [SOD-323_L1.8-W1.3-LS2.5-RD]  82.8 59.31 270 top
D20  -  [LED_0805]  72.01 9.78 270 top
D21  SD103AWS  [SOD-323_L1.8-W1.3-LS2.5-RD]  82.55 9.78 270 top
D22  -  [LED_0805]  40.51 53.88 180 top
D25  -  [LED_0805]  10.92 9.52 180 top
D26  -  [LED_0805]  42.93 9.4 180 top
D27  SD103AWS  [SOD-323_L1.8-W1.3-LS2.5-RD]  35.05 3.81 270 top
D28  SD103AWS  [SOD-323_L1.8-W1.3-LS2.5-RD]  14.86 3.81 90 top
H1  -  [HDR-TH_3P-P2.54-V-F]  31.2 82.27 90 top
H3  -  [HDR-TH_3P-P2.54-V-F]  68.9 61.17 270 top
H4  -  [HDR-TH_4P-P2.54-V-F]  86.3 87.17 180 top
H5  -  [HDR-TH_2P-P2.54-V-F]  92.34 10.06 270 top
H6  -  [HDR-TH_2P-P2.54-V-F]  92.34 24.92 270 top
H7  -  [HDR-TH_2P-P2.54-V-F]  42.55 21.09 270 top
H8  PZ254-3-03-Z-2.5-G0  [HDR-TH_9P-P2.54-V-M-R3-C3-S2.54]  33.41 34.51 0 top
H9  -  [HDR-TH_4P-P2.54-V-F-R2-C2-S2.54]  9.85 31.55 0 top
H10  -  [HDR-TH_2P-P2.54-V-F]  7.37 76.83 90 top
H11  -  [HDR-TH_2P-P2.54-V-F]  7.24 60.71 90 top
H12  -  [HDR-TH_2P-P2.54-V-F]  38.1 66.04 270 top
H13  -  [HDR-TH_2P-P2.54-V-F]  7.62 18.92 90 top
H14  -  [HDR-TH_2P-P2.54-V-F]  62.61 71.22 90 top
H15  -  [HDR-TH_2P-P2.54-V-F]  92.58 71.37 90 top
NOREF  -  [Pad_e550]  22.46 8.77 0 top
NOREF#2  -  [Pad_e554]  19.86 53.27 0 top
NOREF#3  -  [Pad_e551]  25 8.77 0 top
NOREF#4  -  [Pad_e36]  92 19.97 180 top
NOREF#5  -  [Pad_e556]  24.94 53.27 0 top
NOREF#6  -  [Pad_e552]  27.54 8.77 0 top
NOREF#7  -  [Pad_e555]  22.4 53.27 0 top
PR1  10kΩ  [R_3296]  36.9 75.27 0 top
PR2  10kΩ  [R_3296]  68.76 82.22 0 top
PR3  500k  [R_3296]  18.8 34.27 0 top
PR4  10kΩ  [R_3296]  35 25.67 0 top
R1  10K  [R0805#2]  10.16 76.58 90 top
R2  10K  [R0805#2]  15.5 64.92 90 top
R3  10K  [R0805#2]  14.3 68.07 180 top
R4  10K  [R0805#2]  10.29 60.45 90 top
R5  10K  [R0805#2]  31.37 69.6 0 top
R6  10K  [R0805#2]  31.37 67.23 0 top
R7  10K  [R0805#2]  31.37 62.48 180 top
R8  10K  [R0805#2]  26.7 82.43 0 top
R9  10K  [R0805#2]  37.8 71.77 180 top
R10  10K  [R0805#2]  30.8 74.97 270 top
R11  10K  [R0805#2]  26.7 84.91 0 top
R12  10K  [R0805#2]  26.7 79.95 180 top
R13  10K  [R0805#2]  20.07 77.47 180 top
R14  10K  [R0805#2]  13.64 82.43 180 top
R24  51Ω  [R0805#2]  37.34 15.33 180 top
R34  10K  [R0805#2]  4.44 53.97 0 top
R35  10K  [R0805#2]  74.93 59.18 270 top
R36  10K  [R0805#2]  70.36 72.09 0 top
R37  10K  [R0805#2]  70.36 74.59 180 top
R38  10K  [R0805#2]  78.6 76.87 90 top
R39  10K  [R0805#2]  78.67 65.99 90 top
R40  10K  [R0805#2]  84.46 72.88 180 top
R41  10K  [R0805#2]  84.46 67.88 180 top
R42  10K  [R0805#2]  73.87 65.99 90 top
R43  10K  [R0805#2]  62.36 81.08 270 top
R45  10K  [R0805#2]  81.21 83.82 180 top
R46  10K  [R0805#2]  86.38 18.2 270 top
R47  10K  [R0805#2]  83.45 18.2 90 top
R48  10K  [R0805#2]  83.45 23.27 270 top
R49  10K  [R0805#2]  86.38 23.27 90 top
R50  10K  [R0805#2]  92 17.17 90 top
R51  10K  [R0805#2]  68.13 15.21 0 top
R52  10K  [R0805#2]  68.09 26.19 180 top
R53  10K  [R0805#2]  74.29 9.65 270 top
R54  10K  [R0805#2]  36.45 53.88 0 top
R55  2.4k  [R0805#2]  20.21 26.34 270 top
R56  1k  [R0805#2]  21.97 20.07 90 top
R57  0  [R0805#2]  11.87 20.14 180 top
R58  51Ω  [R0805#2]  28.2 23.27 270 top
R59  511Ω  [R0805#2]  25.5 22.27 90 top
R60  51Ω  [R0805#2]  23.56 13.78 0 top
R63  10K  [R0805#2]  6.98 9.52 0 top
R64  10K  [R0805#2]  38.86 9.4 0 top
R65  10K  [R0805#2]  6.18 26.58 90 top
SCREW1  -  [M3螺丝]  4 86.05 0 top
SCREW2  -  [M3螺丝]  41.06 86.01 0 top
SCREW3  -  [M3螺丝]  95.96 85.91 0 top
SCREW4  -  [M3螺丝]  59.02 53.79 0 top
SCREW5  -  [M3螺丝]  4.06 48.97 0 top
SCREW6  -  [M3螺丝]  40.77 49.02 0 top
SCREW7  -  [M3螺丝]  96.09 53.91 0 top
SCREW8  -  [M3螺丝]  59.12 86.02 0 top
SCREW17  -  [M3螺丝]  4.04 3.97 0 top
SCREW18  -  [M3螺丝]  45.92 4.07 0 top
SCREW19  -  [M3螺丝]  59.06 30.99 0 top
SCREW20  -  [M3螺丝]  59.02 4 0 top
SCREW21  -  [M3螺丝]  46.01 35.88 0 top
SCREW22  -  [M3螺丝]  4.05 35.93 0 top
SCREW23  -  [M3螺丝]  95.98 4 0 top
SCREW24  -  [M3螺丝]  96.01 30.99 0 top
U1  VCA821ID  [SOIC-14_L8.7-W3.9-P1.27-LS6.0-BL]  23.11 64.77 270 top
U2  OP07CDR  [SOIC-8_L4.9-W3.9-P1.27-LS6.0-BL]  20.1 81.73 90 top
U15  MCP41010T-I/SN  [SOIC-8_L4.9-W3.9-P1.27-LS6.0-BL]  87.56 81.67 90 top
U17  -  [SMA]  51 25.68 180 top
U22  -  [SMA]  45.97 73.18 180 top
U23  -  [SMA]  -0.89 53.59 0 top
U24  -  [SMA]  -0.89 69.72 0 top
U25  AD8367ARUZ  [TSSOP-14_L5.0-W4.4-P0.65-LS6.4-BL]  77.47 71.63 270 top
U26  -  [SMA]  54.22 64.11 0 top
U27  -  [SMA]  100.97 75.82 180 top
U28  AD8302ARUZ-RL7  [TSSOP-14_L5.0-W4.4-P0.65-LS6.4-BL]  76.85 20.61 270 top
U29  -  [SMA]  54.1 5.66 0 top
U30  -  [SMA]  54.03 17.75 0 top
U31  -  [SMA]  100.85 29.5 180 top
U32  -  [SMA]  100.85 17.3 180 top
U33  TLC14CD  [SOIC-8_L4.9-W3.9-P1.27-LS6.0-BL]  17.65 19.69 180 top
U34  -  [SMA]  -0.76 14.22 0 top
U35  OP07CDR  [SOIC-8_L4.9-W3.9-P1.27-LS6.0-BL]  31.23 18.25 270 top
增益模式  -  [HDR-TH_3P-P2.54-V-F]  60.6 61.17 270 top
手控  10K  [R0805#2]  75.06 81.08 90 top
程控  10K  [R0805#2]  81.21 81.67 180 top

## Footprints (pads in the part's own frame, mm; a bottom-side part is the same pattern mirrored in y, then rotated)
C1210
  rect 1.635x2.7 smd: 1(-1.518,0) 2(1.518,0)
CONN-TH_XH2.54-6P
  round 1.65 hole 1.1: 1(-6.25,0) 2(-3.75,0) 3(-1.25,0) 4(1.25,0) 5(3.75,0) 6(6.25,0)
HDR-TH_2P-P2.54-V-F
  rect 1.7x1.7 hole 1: 1(-1.27,0)
  round 1.7 hole 1: 2(1.27,0)
HDR-TH_3P-P2.54-V-F
  rect 1.575x1.575 hole 1.02: 1(-2.54,0)
  round 1.575 hole 1.02: 2(0,0) 3(2.54,0)
HDR-TH_4P-P2.54-V-F
  rect 1.7x1.7 hole 1.1: 1(-3.81,0)
  round 1.7 hole 1.1: 2(-1.27,0) 3(1.27,0) 4(3.81,0)
HDR-TH_4P-P2.54-V-F-R2-C2-S2.54
  round 1.8 hole 1: 1(-1.27,-1.27) 2(-1.27,1.27) 3(1.27,-1.27) 4(1.27,1.27)
HDR-TH_9P-P2.54-V-M-R3-C3-S2.54
  rect 1.524x1.6 hole 1.02: 1-1(-2.54,-2.54)
  round 1.6 hole 1.02: 1-2(-2.54,0) 1-3(-2.54,2.54) 2-1(0,-2.54) 2-2(0,0) 2-3(0,2.54) 3-1(2.54,-2.54) 3-2(2.54,0) 3-3(2.54,2.54)
LED_0805
  rect 1x1.25 smd: 1(-1.15,0.005) 2(1.05,0.005)
M3螺丝
  round 3.2 hole 3.2: 1(0,0)
Pad_e36
  round 1.524 hole 0.914: 1(0,0)
Pad_e550
  round 1.524 hole 0.914: 1(0,0)
Pad_e551
  round 1.524 hole 0.914: 2(0,0)
Pad_e552
  round 1.524 hole 0.914: 3(0,0)
Pad_e554
  round 1.524 hole 0.914: 1(0,0)
Pad_e555
  round 1.524 hole 0.914: 2(0,0)
Pad_e556
  round 1.524 hole 0.914: 3(0,0)
R0805
  rect 1.133x1.377 smd: 1(-1.111,0) 2(0.889,0)
R0805#2
  rect 1.133x1.377 smd: 1(-1,0) 2(1,0)
R_3296
  round 1.524 hole 0.762: 1(-2.499,-0.127) 2(0,-0.127) 3(2.499,-0.127)
SMA
  rect 4.8x1.2 smd: 1(3.81,8.412) 2(3.81,3.312) 5(3.81,5.862)
  rect 4.8x1.2 smd far side: 3(3.81,3.312) 4(3.81,8.412)
SOD-323_L1.8-W1.3-LS2.5-RD
  rect 1x0.75 smd: 1(-1.173,0) 2(1.173,0)
SOIC-8_L4.9-W3.9-P1.27-LS6.0-BL
  oval 0.588x2.045 smd: 1(-1.905,-2.772) 2(-0.635,-2.772) 3(0.635,-2.772) 4(1.905,-2.772) 5(1.905,2.772) 6(0.635,2.772) 7(-0.635,2.772) 8(-1.905,2.772)
SOIC-14_L8.7-W3.9-P1.27-LS6.0-BL
  oval 0.574x2.038 smd: 1(-3.81,-2.769) 2(-2.54,-2.769) 3(-1.27,-2.769) 4(0,-2.769) 5(1.27,-2.769) 6(2.54,-2.769) 7(3.81,-2.769) 8(3.81,2.769) 9(2.54,2.769) 10(1.27,2.769) 11(0,2.769) 12(-1.27,2.769) 13(-2.54,2.769) 14(-3.81,2.769)
TSSOP-14_L5.0-W4.4-P0.65-LS6.4-BL
  rect 0.4x1.7 smd: 1(-1.95,-2.8) 2(-1.3,-2.8) 3(-0.65,-2.8) 4(0,-2.8) 5(0.65,-2.8) 6(1.3,-2.8) 7(1.95,-2.8) 8(1.95,2.8) 9(1.3,2.8) 10(0.65,2.8) 11(0,2.8) 12(-0.65,2.8) 13(-1.3,2.8) 14(-1.95,2.8)

## Nets
As in the schematic, except:
+5V: C3.2 C4.1 C7.2 C11.2 C12.1 C29.1 C43.2 C44.2 C54.2 C60.2 C61.2 C62.2 C63.2 C72.1 C73.1 C79.2 C88.2 C89.2 D16.1 D19.1 D21.1 D27.1 NOREF#5.3 NOREF#6.3 R9.2 R35.1 R40.1 R41.1 R43.2 R45.2 R53.1 R54.1 R64.1 U1.1 U1.14 U2.7 U15.8 U25.2 U28.4 U33.7 U35.7 增益模式.3
-5V: C5.2 C6.1 C8.2 C9.2 C10.1 C42.2 C45.2 C75.2 C76.2 C81.1 C86.2 C87.2 D14.1 D17.2 D25.1 D28.2 NOREF.1 NOREF#2.1 R10.2 U1.7 U1.8 U2.4 U33.3 U33.4 U35.4
GND: C2.1 C3.1 C4.2 C5.1 C6.2 C7.1 C8.1 C9.1 C10.2 C11.1 C12.2 C29.2 C42.1 C43.1 C44.1 C45.1 C46.1 C47.1 C48.1 C51.2 C52.1 C53.2 C54.1 C55.1 C56.2 C57.2 C60.1 C61.1 C62.1 C63.1 C66.1 C67.1 C68.1 C69.1 C70.1 C71.1 C72.2 C73.2 C74.1 C75.1 C76.1 C79.1 C81.2 C86.1 C87.1 C88.1 C89.1 CN27.3 CN27.4 CN28.3 CN28.4 CN29.3 CN29.4 CN30.3 CN30.4 D15.1 D20.1 D22.1 D26.1 H1.1 H3.3 H4.1 H5.2 H6.1 H7.1 H10.2 H11.2 H12.2 H13.1 H14.2 H15.2 NOREF#3.2 NOREF#7.2 PR2.3 R1.2 R4.2 R7.1 R11.2 R12.1 R24.2 R34.1 R37.1 R38.1 R42.1 R50.1 R51.2 R52.1 R58.1 R60.1 R63.1 R65.2 U1.11 U15.4 U17.1 U17.2 U17.3 U17.4 U22.1 U22.2 U22.3 U22.4 U23.1 U23.2 U23.3 U23.4 U24.1 U24.2 U24.3 U24.4 U25.1 U25.7 U25.8 U25.14 U26.1 U26.2 U26.3 U26.4 U27.1 U27.2 U27.3 U27.4 U28.1 U28.7 U29.1 U29.2 U29.3 U29.4 U30.1 U30.2 U30.3 U30.4 U31.1 U31.2 U31.3 U31.4 U32.1 U32.2 U32.3 U32.4 U33.6 U34.1 U34.2 U34.3 U34.4 增益模式.1
$2N4792: NOREF#4.1 R50.2 U28.11

Pads without a net: PR3 3; SCREW1 1; SCREW2 1; SCREW3 1; SCREW4 1; SCREW5 1; SCREW6 1; SCREW7 1; SCREW8 1; SCREW17 1; SCREW18 1; SCREW19 1; SCREW20 1; SCREW21 1; SCREW22 1; SCREW23 1; SCREW24 1; U1 13; U2 1 5 8; U35 1 5 8

## Via types
v1: diameter 0.61, hole 0.305, Top Layer to Bottom Layer, 25 vias
v2: diameter 0.5, hole 0.305, Top Layer to Bottom Layer, 1 via

## Routing (per net, layer and track width the routed paths; a pad name or vN(x,y) marks a point on that pad's centre or on a via; arc(x,y) is an arc through that point)
+5V: length 298.1
  Top Layer w0.305: 74.67,72.93 73.87,72.93 arc(73.82,72.93) 73.77,72.93 73.54,72.93 arc(73.3,73.03) 73.2,73.27
  Top Layer w0.381: U28.4 75.37,20.61 arc(75.74,20.45) 75.9,20.07 C54.2
  Top Layer w0.508: v1(35.4,71.07) 36.1,71.07 arc(36.59,71.28) R9.2 ; U33.7 18.29,14.01 arc(18.26,13.95) C72.1 C73.1 ; R64.1 28.16,9.4 arc(27.83,9.3) 27.6,9.04 ; C4.1 C12.1 24.56,69.9 arc(24.95,68.97) U1.14 ; 73.2,73.27 73.2,75.77 ; U2.7 15.78,81.1 arc(14.97,80.76) C7.2 ; 86.56,77.65 85.22,77.65 arc(84.92,77.77) 84.8,78.07 84.8,79.75 arc(84.8,79.76) U15.8 83.41,79.76 arc(83.4,79.76) v1(83.4,79.77) ; C79.2 35.26,18.88 U35.7 ; C3.2 C11.2 21.65,69.88 arc(21.26,68.96) U1.1 ; 27.58,8.98 arc(27.55,8.88) NOREF#6.3
  Top Layer w0.762: R54.1 25.55,53.88 arc(25.12,53.7) NOREF#5.3 ; R54.1 v1(35.45,55.67) ; R54.1 35.45,51.95 ; C43.2 79.38,60.2 arc(79.83,60.38) C44.2 82.46,60.83 arc(82.7,60.73) D19.1 ; C43.2 74.95,60.2 arc(74.93,60.19) R35.1 ; C43.2 77.09,61.86 arc(77.41,62.65) 78.2,62.97 86,62.97 arc(86.99,63.38) 87.4,64.37 87.4,67.88 ; 87.4,67.88 87.4,72.9 ; 87.4,67.88 arc(87.4,67.88) 87.39,67.88 R41.1 ; 87.4,72.9 87.4,77.26 arc(87.28,77.55) C29.1 ; 87.4,72.9 arc(87.39,72.88) 87.38,72.88 R40.1 ; C73.1 26.24,11.63 arc(27.2,11.23) 27.6,10.27 27.6,9 arc(27.59,8.99) 27.58,8.98 ; v1(36.3,21.77) 36.3,19.93 arc(36.3,19.93) C79.2 ; v1(35.4,71.07) C4.1 ; D27.1 37.81,4.98 arc(37.84,4.97) C89.2 37.85,9.38 arc(37.85,9.39) R64.1 v1(37.86,10.77) ; D21.1 79.97,10.95 arc(79.82,11.02) C61.2 arc(79.61,10.81) 79.25,10.67 C60.2 arc(76.58,10.66) 76.56,10.65 R53.1 74.29,15.87 arc(74.47,16.3) 74.9,16.47 75.89,16.47 arc(75.9,16.47) C54.2 ; R45.2 v1(78.9,83.82) 61.45,83.82 arc(60.71,83.52) 60.4,82.77 60.4,80.07 62.35,80.07 arc(62.36,80.07) R43.2 62.36,77.62 arc(62.6,77.02) 63.2,76.77 v1(65.2,76.77) 72.2,76.77 arc(72.91,76.48) 73.2,75.77 ; v1(18.1,71.07) C3.2 ; C7.2 14.64,78.61 arc(14.63,78.58) v1(14.6,78.57) ; 35.45,50.03 35.45,51.95 ; 35.45,51.95 arc(35.44,51.94) 35.43,51.93 ; D16.1 35.43,49.43
  Bottom Layer w0.508: v1(78.9,83.82) 78.9,80.27 arc(79.05,79.92) 79.4,79.77 v1(83.4,79.77)
  Bottom Layer w0.762: v1(14.6,78.57) 14.6,72.37 arc(14.98,71.45) 15.9,71.07 v1(18.1,71.07) 18.1,56.57 arc(18.36,55.94) 19,55.67 v1(35.45,55.67) 35.45,70.45 35.44,70.45 35.4,70.49 v1(35.4,71.07) ; 增益模式.3 64.16,58.63 arc(64.9,58.94) 65.2,59.67 v1(65.2,76.77) ; v1(37.86,10.77) 37.86,21.01 arc(37.64,21.55) 37.1,21.77 v1(36.3,21.77)
-5V: length 145.7
  Top Layer w0.508: C10.1 C6.1 26.67,60.17 arc(26.44,60.73) U1.8 ; D25.1 21.71,9.52 arc(22.24,9.3) NOREF.1 ; U33.4 15.75,24.94 arc(15.63,25.22) C75.2 ; C81.1 28.84,13.93 arc(28.53,14.06) 28.4,14.37 28.4,16.29 arc(28.42,16.33) 28.45,16.34 ; C8.2 22.22,85.85 arc(22.7,85.65) 22.9,85.17 22.9,83.67 arc(22.89,83.65) U2.4 ; C5.2 C9.2 21.59,59.72 arc(21.22,60.6) U1.7 ; U33.3 17.02,24.57 arc(17.24,25.11) C76.2
  Top Layer w0.762: 16.07,53.97 9.66,53.97 arc(9.56,53.93) 9.53,53.84 C42.2 arc(9.44,51.65) 9.4,51.56 C45.2 arc(9.41,49.42) 9.43,49.43 D17.2 ; 16.07,53.97 19.16,53.97 arc(19.66,53.77) NOREF#2.1 ; 16.07,53.97 arc(16.09,53.98) 16.1,54 16.1,57.27 arc(16.47,58.17) 17.37,58.55 C5.2 ; v1(30.3,11.77) 30.3,13.87 arc(30.28,13.91) C81.1 ; v1(29,73.97) R10.2 ; C76.2 C75.2 arc(15.33,25.29) 15.29,25.27 v1(13.2,25.27) ; C9.2 C10.1 ; v1(12.07,10.77) D25.1 12.07,7.25 arc(12.07,7.24) C86.2 C87.2 14.82,4.95 arc(14.85,4.96) D28.2 ; C8.2 v1(21.21,87.17) ; v1(28.3,58.57) 26.7,58.57 arc(26.68,58.57) C6.1
  Bottom Layer w0.762: v1(12.07,10.77) 12.07,24.14 arc(12.4,24.94) v1(13.2,25.27) ; v1(21.21,87.17) 27.8,87.17 arc(28.65,86.82) 29,85.97 v1(29,73.97) 29,59.27 arc(28.79,58.78) v1(28.3,58.57) ; NOREF.1 22.46,10.73 arc(22.76,11.47) 23.5,11.77 v1(30.3,11.77)
AGND: length 4.9
  Top Layer w0.508: R65.1 C64.2 C65.2
GND: length 1.5
  Top Layer w0.508: U1.11 27.4,64.77 arc(27.4,64.77) v1(27.4,64.77)
  vias: v1(17.1,73.77) v1(26.4,69.57)
AD8301_OUT: length 32.7
  Top Layer w0.508: H8.2-3 H8.2-2 H8.2-1 arc(33.4,31.97) 33.4,31.97 33.4,30.57 arc(33.08,29.8) 32.3,29.47 23.3,29.47 arc(22.36,29.08) 21.97,28.14 R56.2 22.01,21.07 arc(22.99,20.66) 23.4,19.67 23.4,16.91 arc(23.15,16.31) C77.1
AD8367_VG: length 33.3
  Top Layer w0.381: U25.5 76.09,70.98 arc(76.1,70.98) v1(76.1,70.97)
  Top Layer w0.508: 手控.2 v1(77.6,82.08) 79.8,82.08 arc(80.09,81.96) 程控.2
  Bottom Layer w0.305: v1(76.1,70.97) 69.8,70.97 arc(69.16,70.71) 68.9,70.07 H3.1
  Bottom Layer w0.381: v1(76.1,70.97) 77.1,70.97 arc(77.45,71.12) 77.6,71.47 77.6,82.07
C1: length 2.7
  Top Layer w0.508: H9.1 8.58,27.6 arc(8.57,27.59) C64.1
C2: length 2.7
  Top Layer w0.508: H9.3 11.12,27.64 arc(11.1,27.6) C65.1
C3: length 3.1
  Top Layer w0.508: 30.67,31.97 28,31.97 arc(27.79,32.06) C66.2
C4: length 3
  Top Layer w0.508: C67.2 30.57,34.61 ; 30.77,34.61 arc(30.84,34.58) H8.1-2
C5: length 3
  Top Layer w0.508: C68.2 30.52,36.91 ; 30.72,36.91 arc(30.82,36.95) H8.1-3
C6: length 3
  Top Layer w0.508: 36.35,37.05 39.09,37.05 arc(39.19,37.01) C69.2
C7: length 2.9
  Top Layer w0.508: 36.35,34.51 39.14,34.51 arc(39.2,34.54) C70.2
C8: length 3.1
  Top Layer w0.508: H8.3-1 38.5,31.97 ; 38.9,31.97 arc(39.13,32.07) C71.2
SW1: length 24.2
  Top Layer w0.508: H9.2 H9.4 14.98,32.82 arc(15.91,33.21) 16.3,34.15 ; U33.1 19.56,22.73 arc(19.78,23.26) v1(20.3,23.47)
  Bottom Layer w0.508: 16.3,34.15 16.3,24.47 arc(16.59,23.77) 17.3,23.47 v1(20.3,23.47)
VG_821: length 32.1
  Top Layer w0.508: C46.2 R14.2 arc(12.62,82.39) 12.58,82.37 11.8,82.37 arc(11.45,82.23) 11.3,81.87 11.3,77.07 arc(11.77,75.94) 12.9,75.47 22.3,75.47 arc(22.87,75.24) 23.1,74.67 23.1,67.67 arc(22.99,67.42) 22.74,67.31 20.34,67.31
VRW: length 15
  Top Layer w0.508: H1.3 36.06,84.81 arc(36.65,84.57) 36.9,83.97 36.9,75.15
$1N927: length 25.4
  Top Layer w0.508: U24.5 7.35,75.58 arc(7.36,75.58) H10.1 10.14,75.56 arc(10.16,75.57) R1.1 arc(10.19,75.57) 10.2,75.54 10.2,70.97 arc(10.58,70.05) 11.5,69.67 16.8,69.67 arc(17.86,69.23) 18.3,68.17 18.3,66.97 arc(18.57,66.31) 19.23,66.04 U1.3
$1N932: length 9.7
  Top Layer w0.508: R2.2 15.5,67.87 arc(15.44,68.01) R3.1 16.6,68.07 arc(17.09,67.87) 17.3,67.37 17.3,66.27 arc(17.74,65.21) 18.8,64.77 20.34,64.77 arc(20.34,64.77) U1.4
$1N947: length 2.3
  Top Layer w0.508: R3.2 13.3,66.2 arc(13.22,66.01) C1.1
$1N953: length 7.6
  Top Layer w0.508: U1.5 15.92,63.5 arc(15.62,63.62) R2.1 C1.2
$1N958: length 18.5
  Top Layer w0.508: U23.5 7.22,59.46 H11.1 10.27,59.44 R4.1 12.32,61.49 arc(13.15,62.04) 14.12,62.23 U1.6
$1N1412: length 7.5
  Top Layer w0.508: U1.12 27.27,66.04 arc(27.64,66.2) 27.8,66.57 27.8,68.97 arc(27.98,69.4) 28.4,69.57 30.35,69.57 arc(30.36,69.58) R5.1
$1N1418: length 10.8
  Top Layer w0.508: U1.10 28.43,63.5 arc(28.76,63.64) 28.9,63.97 28.9,66.37 arc(29.11,66.87) 29.6,67.07 30.22,67.07 arc(30.32,67.12) R6.1 30.37,67.6 R5.2
$1N1424: length 7.5
  Top Layer w0.508: U1.9 30.12,62.23 arc(30.29,62.3) R7.2 ; C2.2 30.37,62.14 arc(30.35,62.09) 30.3,62.07
$1N1956: length 2.3
  Top Layer w0.762: D15.2 74.88,58.13 arc(74.92,58.15) R35.2
$1N1959: length 2
  Top Layer w0.762: 7.46,53.97 5.45,53.97 arc(5.45,53.97) R34.2
$1N1963: length 7.8
  Top Layer w0.762: CN27.2 CN27.1 16.11,48.28 arc(15.75,47.43) 14.9,47.07 12.21,47.07 arc(12.2,47.08) D17.1
$1N1964: length 8.1
  Top Layer w0.762: CN27.5 CN27.6 28.61,47.87 arc(28.84,47.31) 29.4,47.07 32.62,47.07 arc(32.63,47.08) D16.2
$1N2033: length 8.7
  Top Layer w0.508: R13.1 21.07,80.54 arc(21.22,80.92) 21.6,81.07 22.85,81.07 arc(22.86,81.08) U2.2 24.56,81.1 arc(25.37,80.76) R12.2
$1N2043: length 9.1
  Top Layer w0.508: R13.2 19.07,81.81 arc(18.9,82.21) 18.5,82.37 17.33,82.37 arc(17.33,82.37) 17.33,82.37 14.7,82.37 R14.1
$1N2183: length 5.3
  Top Layer w0.508: R11.1 R8.1 arc(25.68,82.38) 25.64,82.37 22.87,82.37
$1N2225: length 3.6
  Top Layer w0.508: R8.2 31.04,82.43 arc(31.15,82.38) H1.2
$1N2322: length 3.7
  Top Layer w0.508: 39.4,75.15 39.4,72.37 arc(39.22,71.95) R9.1
$1N2326: length 4.1
  Top Layer w0.508: R10.1 33.57,75.97 arc(34.16,75.73) 34.4,75.15
$1N2584: length 9.9
  Top Layer w0.508: R6.2 38.02,67.23 arc(38.08,67.25) H12.1 42.06,67.31 arc(42.13,67.34) 42.16,67.42
$1N3187: length 3.4
  Top Layer w0.305: U25.3 71.82,72.28 arc(71.57,72.23) R36.2
$1N3196: length 17.8
  Top Layer w0.508: U26.5 62.58,69.97 arc(62.6,69.97) H14.1 65.18,69.95 arc(65.83,70.22) 66.1,70.87 66.1,73.87 arc(66.31,74.37) 66.8,74.57 69.34,74.57 arc(69.35,74.58) R37.2 69.36,72.09 arc(69.36,72.09) R36.1
$1N3201: length 14
  Top Layer w0.381: U25.6 72.07,70.33 arc(71.54,70.11) C47.2
  Top Layer w0.508: H3.2 69.9,61.17 arc(70.82,61.55) 71.2,62.47 71.2,69.46 arc(71.24,69.55) C47.2
$1N3346: length 24
  Top Layer w0.305: U25.4 73.87,71.63 arc(73.82,71.63) 73.77,71.63 73.51,71.63 arc(73.5,71.63) v2(73.5,71.62)
  Top Layer w0.508: v1(66.6,68.77) 66.6,61.97 arc(66.37,61.41) 65.8,61.17 增益模式.2
  Bottom Layer w0.508: v2(73.5,71.62) 66.95,71.62 arc(66.7,71.52) 66.6,71.27 v1(66.6,68.77)
$1N3385: length 6.6
  Top Layer w0.305: C50.2 76.2,73.67 arc(76.42,73.15) 76.94,72.93 80.27,72.93
$1N3390: length 2.4
  Top Layer w0.508: C50.1 78.55,77.82 arc(78.58,77.83) R38.2
$1N3425: length 5.3
  Top Layer w0.381: R39.2 78.67,70.24 arc(78.88,70.76) 79.4,70.97 80.26,70.97 arc(80.27,70.97) U25.10
$1N3431: length 2.4
  Top Layer w0.508: 76.27,64.99 R39.1
$1N3468: length 5.5
  Top Layer w0.305: U25.9 arc(80.28,70.36) 80.31,70.37 81.5,70.37 arc(81.85,70.23) 82,69.87 82,67.92 arc(81.73,67.27) C48.2
$1N3506: length 26.2
  Top Layer w0.305: 76.27,66.99 v1(76.27,68.17)
  Top Layer w0.508: R42.2 76.27,66.99 ; H15.1 97.01,70.1 arc(97.11,70.06) U27.5
  Bottom Layer w0.508: v1(76.27,68.17) 92,68.17 arc(92.42,68.35) 92.6,68.77 92.6,70.09 arc(92.6,70.1) H15.1
$1N3541: length 6
  Top Layer w0.305: U25.12 81.07,72.28 arc(81.12,72.28) 81.17,72.28 82.85,72.28 arc(83.28,72.45) R40.2
  Top Layer w0.508: 83.46,75.38 R40.2
$1N3546: length 6.1
  Top Layer w0.305: U25.11 82.21,71.63 arc(83.09,71.26) C51.1
  Top Layer w0.508: C51.1 83.46,68.18
$1N4146: length 3.9
  Top Layer w0.508: R43.1 66.24,82.08 arc(66.26,82.08) 66.26,82.1
$1N4385: length 2.7
  Top Layer w0.508: U15.5 82.46,83.57 arc(82.28,83.65) R45.1
$1N4386: length 4.2
  Top Layer w0.508: U15.6 U15.7 arc(84.6,81.48) 84.15,81.67 程控.1
$1N4389: length 23
  Top Layer w0.381: H4.4 82.49,88.36 arc(82.67,88.79) 83.1,88.97 91.9,88.97 arc(92.61,88.68) 92.9,87.97 92.9,80.37 arc(92.72,79.95) 92.3,79.77 90.34,79.77 arc(90.33,79.77) U15.1
$1N4390: length 9.6
  Top Layer w0.381: H4.3 86.86,85.35 arc(87.41,84.52) 87.6,83.55 87.6,81.67 arc(87.78,81.25) 88.2,81.07 90.29,81.07 arc(90.32,81.06) U15.2
$1N4391: length 7.1
  Top Layer w0.381: H4.2 arc(88.3,86.87) 88.6,86.14 88.6,82.67 arc(88.72,82.39) 89,82.27 90.3,82.27 arc(90.32,82.28) U15.3
$1N4449: length 8
  Top Layer w0.508: 手控.1 69.6,80.08 arc(69.03,80.31) 68.8,80.87 68.8,82.06 arc(68.79,82.09) 68.76,82.1
$1N4593: length 2.5
  Top Layer w0.508: CN28.1 CN28.2
$1N4594: length 7.4
  Top Layer w0.762: CN28.5 CN28.6 arc(83.07,53.99) 82.8,54.64 D19.2
$1N6399: length 2
  Top Layer w0.762: R54.2 39.46,53.88 arc(39.46,53.88) 39.46,53.88
$2N3603: length 17.2
  Top Layer w0.508: PR4.3 PR4.2 35,23.77 arc(34.59,22.78) 33.6,22.37 32.8,22.37 arc(31.95,22.02) 31.6,21.17 31.6,18.17 arc(31.78,17.75) 32.2,17.57 33.96,17.57 arc(33.99,17.58) U35.6 36.29,17.61 C80.1
$2N3604: length 13.2
  Top Layer w0.508: R24.1 38.34,17.59 arc(38.33,17.62) C80.2 42.06,17.63 arc(42.44,17.79) 42.6,18.17 42.6,19.76 arc(42.58,19.8) H7.2 47.18,19.82 arc(47.19,19.82) U17.5
$2N3622: length 7.4
  Top Layer w0.508: R60.2 C77.2 24.56,16.73 arc(24.83,17.4) 25.5,17.67 28.39,17.67 arc(28.44,17.66) 28.45,17.61
$2N3623: length 8.3
  Top Layer w0.508: 28.45,18.88 arc(28.45,18.88) 28.44,18.87 26.3,18.87 arc(25.73,19.11) 25.5,19.67 R59.1 27.2,21.27 arc(27.91,21.57) R58.2
$2N3624: length 8.9
  Top Layer w0.508: PR4.1 26.27,25.55 arc(25.73,25.32) 25.5,24.77 R59.2
$2N3626: length 3.7
  Top Layer w0.508: U33.2 18.29,23.36 20.21,25.28 R55.2
$2N3634: length 8.2
  Top Layer w0.508: R56.1 16.39,19.07 arc(15.9,18.86) 15.7,18.37 15.7,16.96 arc(15.71,16.93) U33.5
$2N3638: length 14.1
  Top Layer w0.508: U33.8 19.56,15.61 v1(20.1,15.07) ; v1(14.3,17.87) 12.89,17.87 arc(12.87,17.87) C74.2 R57.1
  Bottom Layer w0.508: v1(20.1,15.07) 14.9,15.07 arc(14.48,15.25) 14.3,15.67 v1(14.3,17.87)
$2N3668: length 2
  Top Layer w0.508: R64.2 41.87,9.4 arc(41.87,9.4) D26.2
$2N3679: length 7.1
  Top Layer w0.762: CN30.2 CN30.1 18.7,3.77 arc(18.38,2.99) 17.6,2.67 14.89,2.67 arc(14.87,2.66) D28.1
$2N3680: length 7.3
  Top Layer w0.762: CN30.5 CN30.6 31.2,3.38 arc(31.4,2.88) 31.9,2.67 35.02,2.67 arc(35.04,2.66) D27.2
$2N3682: length 1.9
  Top Layer w0.762: D25.2 7.99,9.52 arc(7.99,9.52) R63.2
$2N3685: length 7.9
  Top Layer w0.508: U34.5 7.51,20.09 arc(7.59,20.12) H13.2 10.81,20.19 arc(10.85,20.18) R57.2
$2N3731: length 7.6
  Top Layer w0.508: R55.1 20.21,32.74 arc(19.79,33.73) 18.8,34.15
$2N4779: length 11.7
  Top Layer w0.508: U30.5 arc(57.92,23.82) 58.13,23.91 C59.2 67.09,26.19 arc(67.09,26.19) R52.2
$2N4783: length 14.9
  Top Layer w0.508: U29.5 66.64,11.52 arc(66.97,11.65) 67.1,11.97 67.1,15.18 arc(67.11,15.2) R51.1 67.13,17.38 arc(67.12,17.41) C58.2
$2N4786: length 2.3
  Top Layer w0.762: D20.2 72.09,8.65 R53.2
$2N4787: length 7.6
  Top Layer w0.305: U28.13 80.03,21.91 arc(81.01,22.1) 81.83,22.65 R48.1
  Top Layer w0.508: R48.1 R49.2
$2N4791: length 7.5
  Top Layer w0.305: U28.9 80.3,19.31 arc(81.27,19.11) 82.09,18.56 R47.1 R46.2
$2N4792: length 14.3
  Top Layer w0.28: U28.11 90.47,20.61 arc(91.3,20.44) NOREF#4.1
  Top Layer w0.457: NOREF#4.1 R50.2
$2N4794: length 11.5
  Top Layer w0.508: R49.1 90.96,22.27 arc(91.94,22.68) H6.2 97.02,23.65 arc(97.04,23.65) U31.5
$2N4795: length 17.9
  Top Layer w0.508: R46.1 88.57,19.2 arc(89.23,18.93) 89.5,18.27 89.5,12.07 arc(89.71,11.58) 90.2,11.37 92.31,11.37 arc(92.33,11.36) H5.1 96.94,11.33 arc(97.01,11.37) U32.5
$2N4798: length 7.6
  Top Layer w0.762: D21.2 82.55,4.34 arc(82.71,3.97) CN29.6 CN29.5
$2N4801: length 2.5
  Top Layer w0.508: CN29.1 CN29.2
$2N4806: length 4.1
  Top Layer w0.508: 79.7,22.6 79.7,24.37 arc(79.5,24.85) 79.02,25.05 C55.2
$2N4807: length 4.1
  Top Layer w0.305: U28.12 81.38,21.26 arc(82.36,21.45) 83.18,22 R48.2
$2N4808: length 4
  Top Layer w0.305: R47.2 83.44,19.21 arc(82.62,19.76) 81.65,19.96 U28.10
$2N4809: length 2.9
  Top Layer w0.381: U28.8 79.65,17.53 arc(79.31,16.72) C53.1
$2N4812: length 5.1
  Top Layer w0.305: U28.5 73.25,19.96 arc(73.2,19.96) 73.15,19.96 70.01,19.96 arc(69.51,19.86) C56.1
$2N4813: length 5.1
  Top Layer w0.305: U28.3 70.28,21.26 arc(69.64,21.38) C57.1
$2N4814: length 5.7
  Top Layer w0.305: C59.1 70.35,22.65 arc(71.18,22.1) 72.15,21.91 73.15,21.91 arc(73.2,21.91) 73.25,21.91 U28.2
$2N4816: length 5.6
  Top Layer w0.305: U28.6 72.03,19.31 arc(71.06,19.11) 70.24,18.56 C58.1

## Copper pours and planes (outline as drawn; the poured copper is in the pictures)
GND on Top Layer: -14.26,103.29 115.5,103.29 115.5,-18.41 -14.26,-18.41
GND on Bottom Layer: -11.81,101.54 108.14,101.54 108.14,-17.71 -11.81,-17.71

Small or netless copper shapes (teardrops, artwork), in the pictures only: 367 on Top Layer, 15 on Bottom Layer

## Text on the board
Bottom Silkscreen Layer: RP3 | RP2 | RP1 | LP3 | LP2 | LP1 | CLK2 | CLK1 | 10Hz~50Hz | 2.6Hz~10Hz | 6kHz~26kHz | 50Hz~240Hz | 1.5kHz~6kHz | 240Hz~1.5kHz
Top Silkscreen Layer: 负增益 | 正增益 | 鉴幅输出 | 鉴相输出 | LPx | RPx | 手控 | 程控 | CLK1 | CLK2 | CLK | SI | GND | CS | VCA_VCA821 | TLC14_Filter | AD8302相位检波器 | VCA_AD8367 | 截至频率调节 | 放大倍数调节
